# EAGLE schematic FLYTE_3.02 (EAGLE 9.6.2)
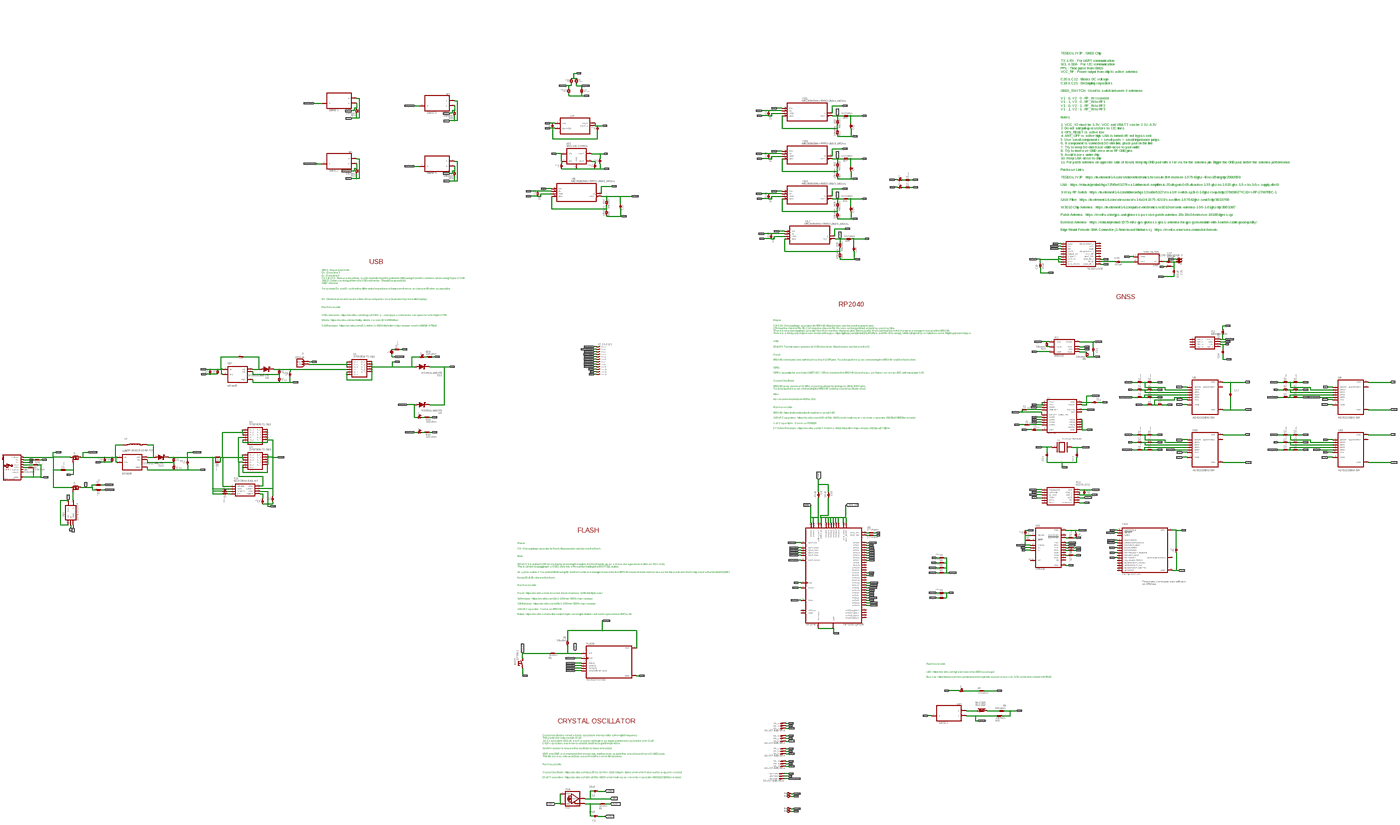
[diagram p0: schematic, sheet 1, overview]
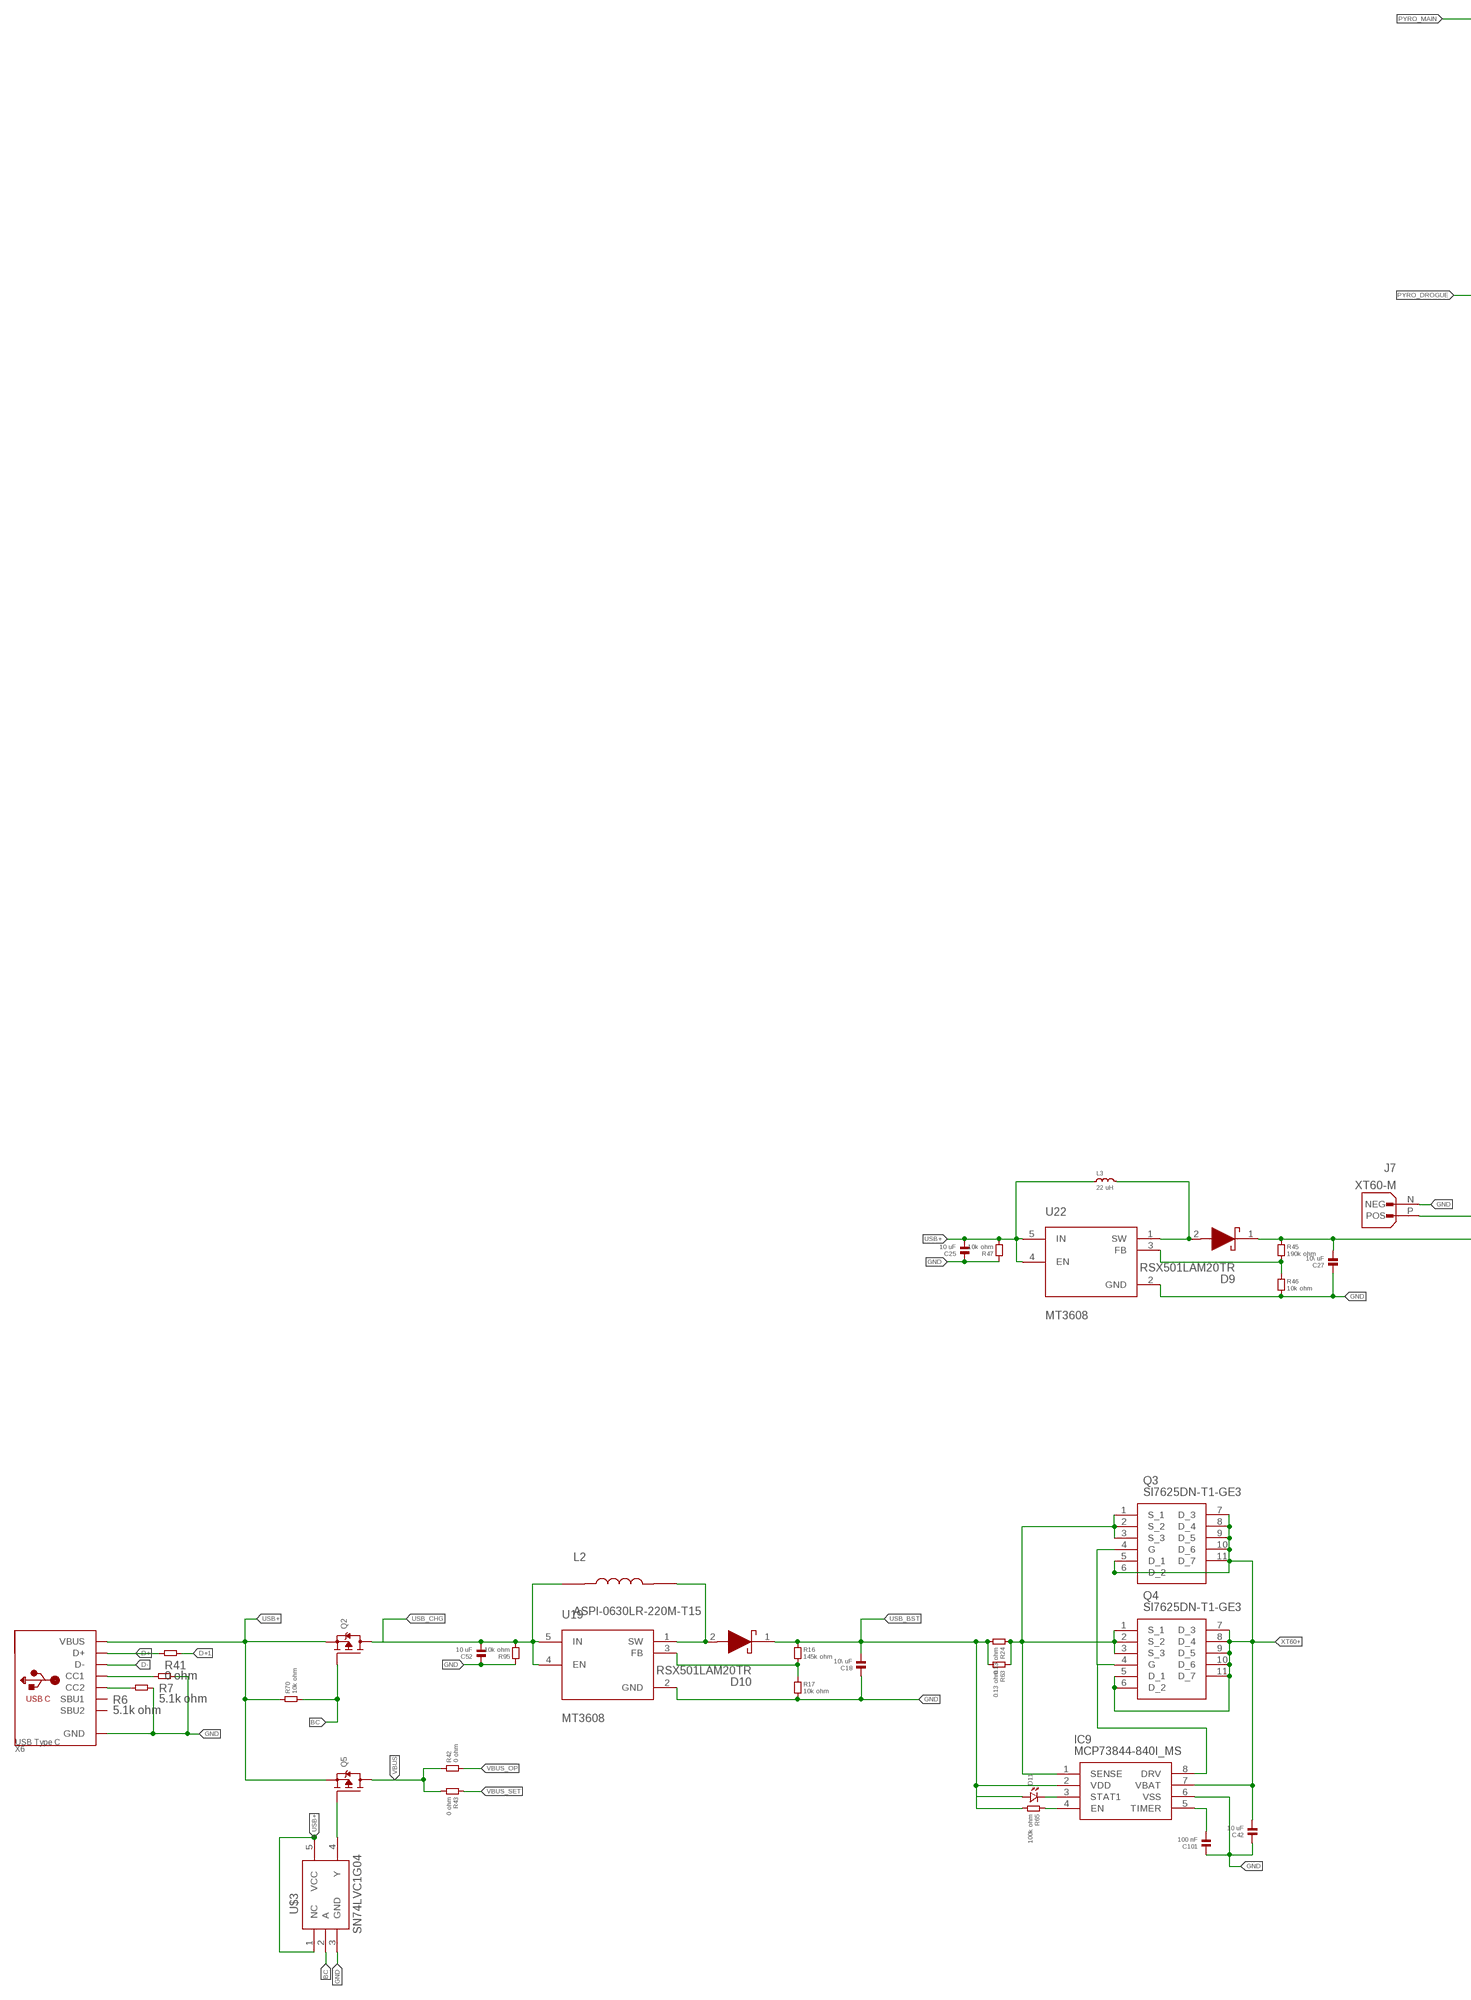
[diagram p1: schematic, sheet 1, part 1 of 6]
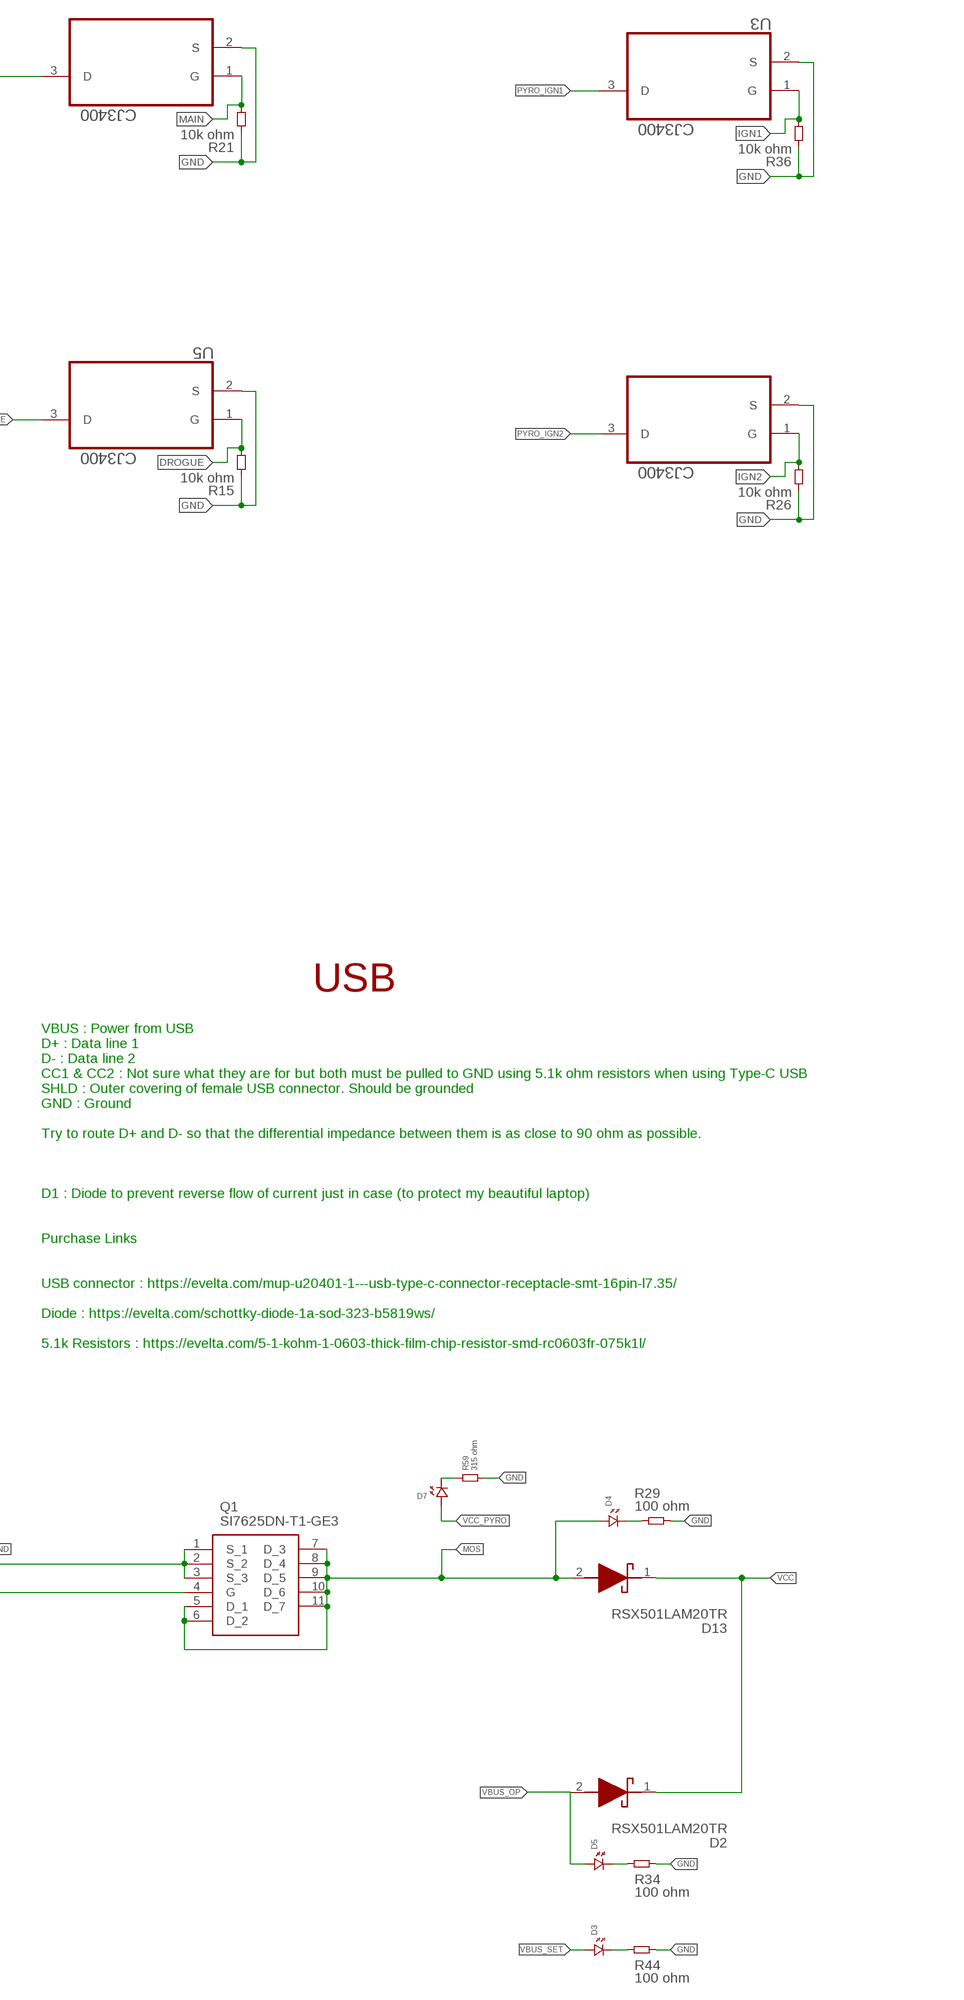
[diagram p2: schematic, sheet 1, part 2 of 6]
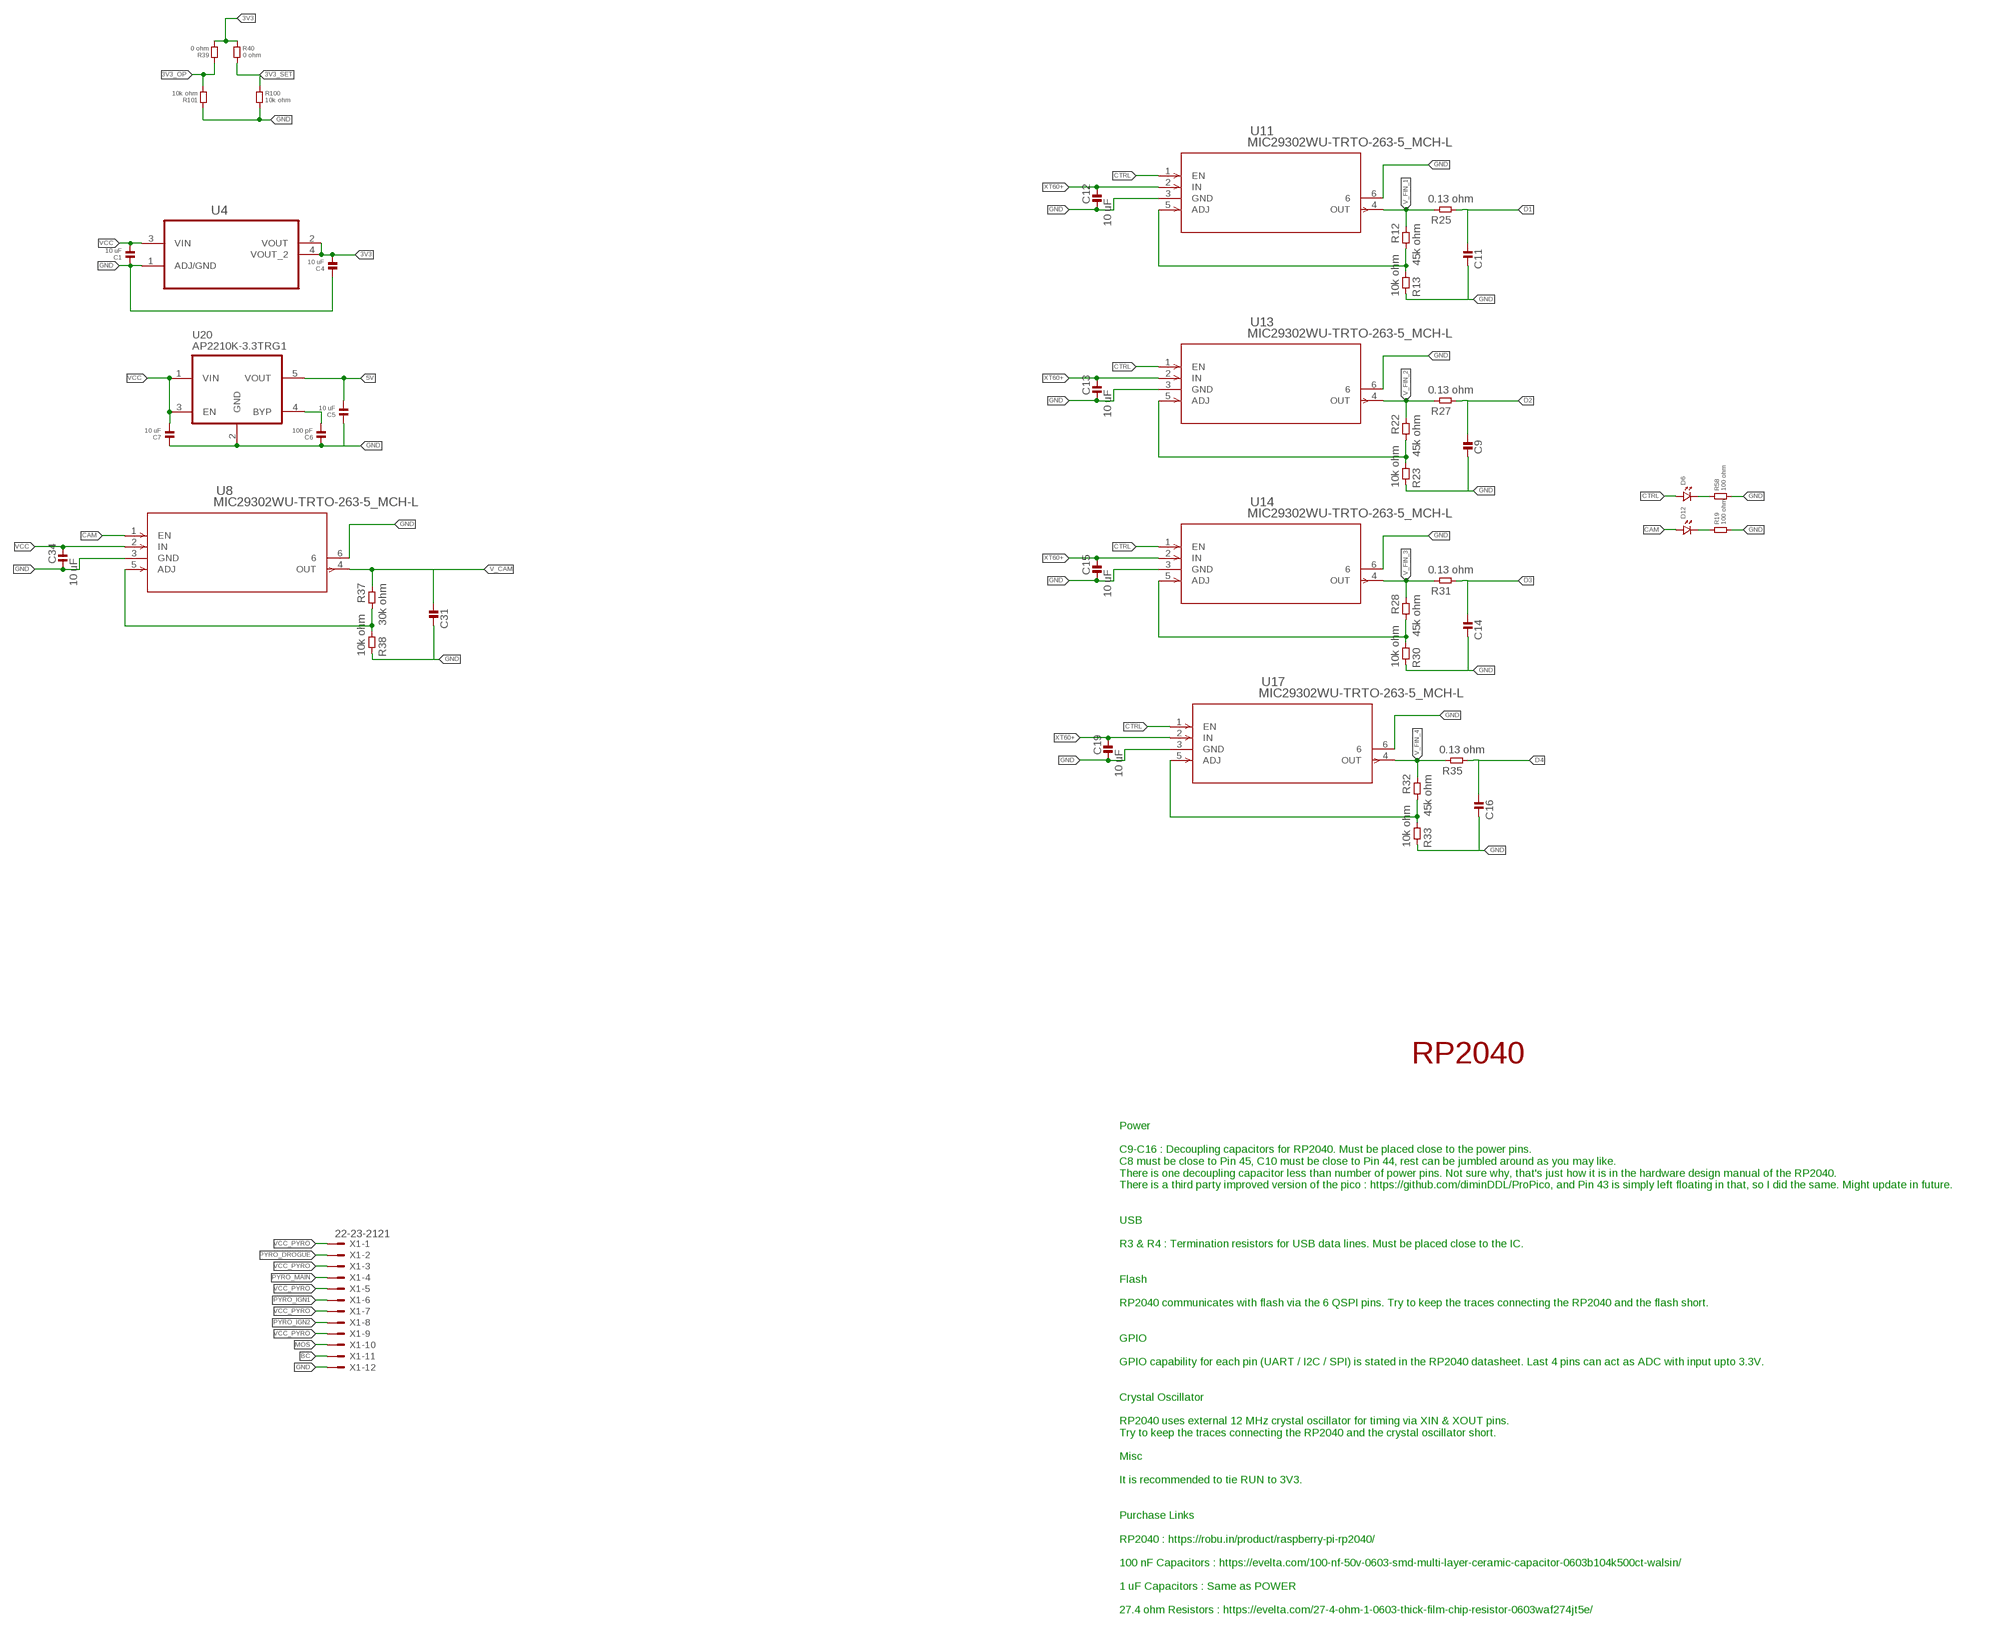
[diagram p3: schematic, sheet 1, part 3 of 6]
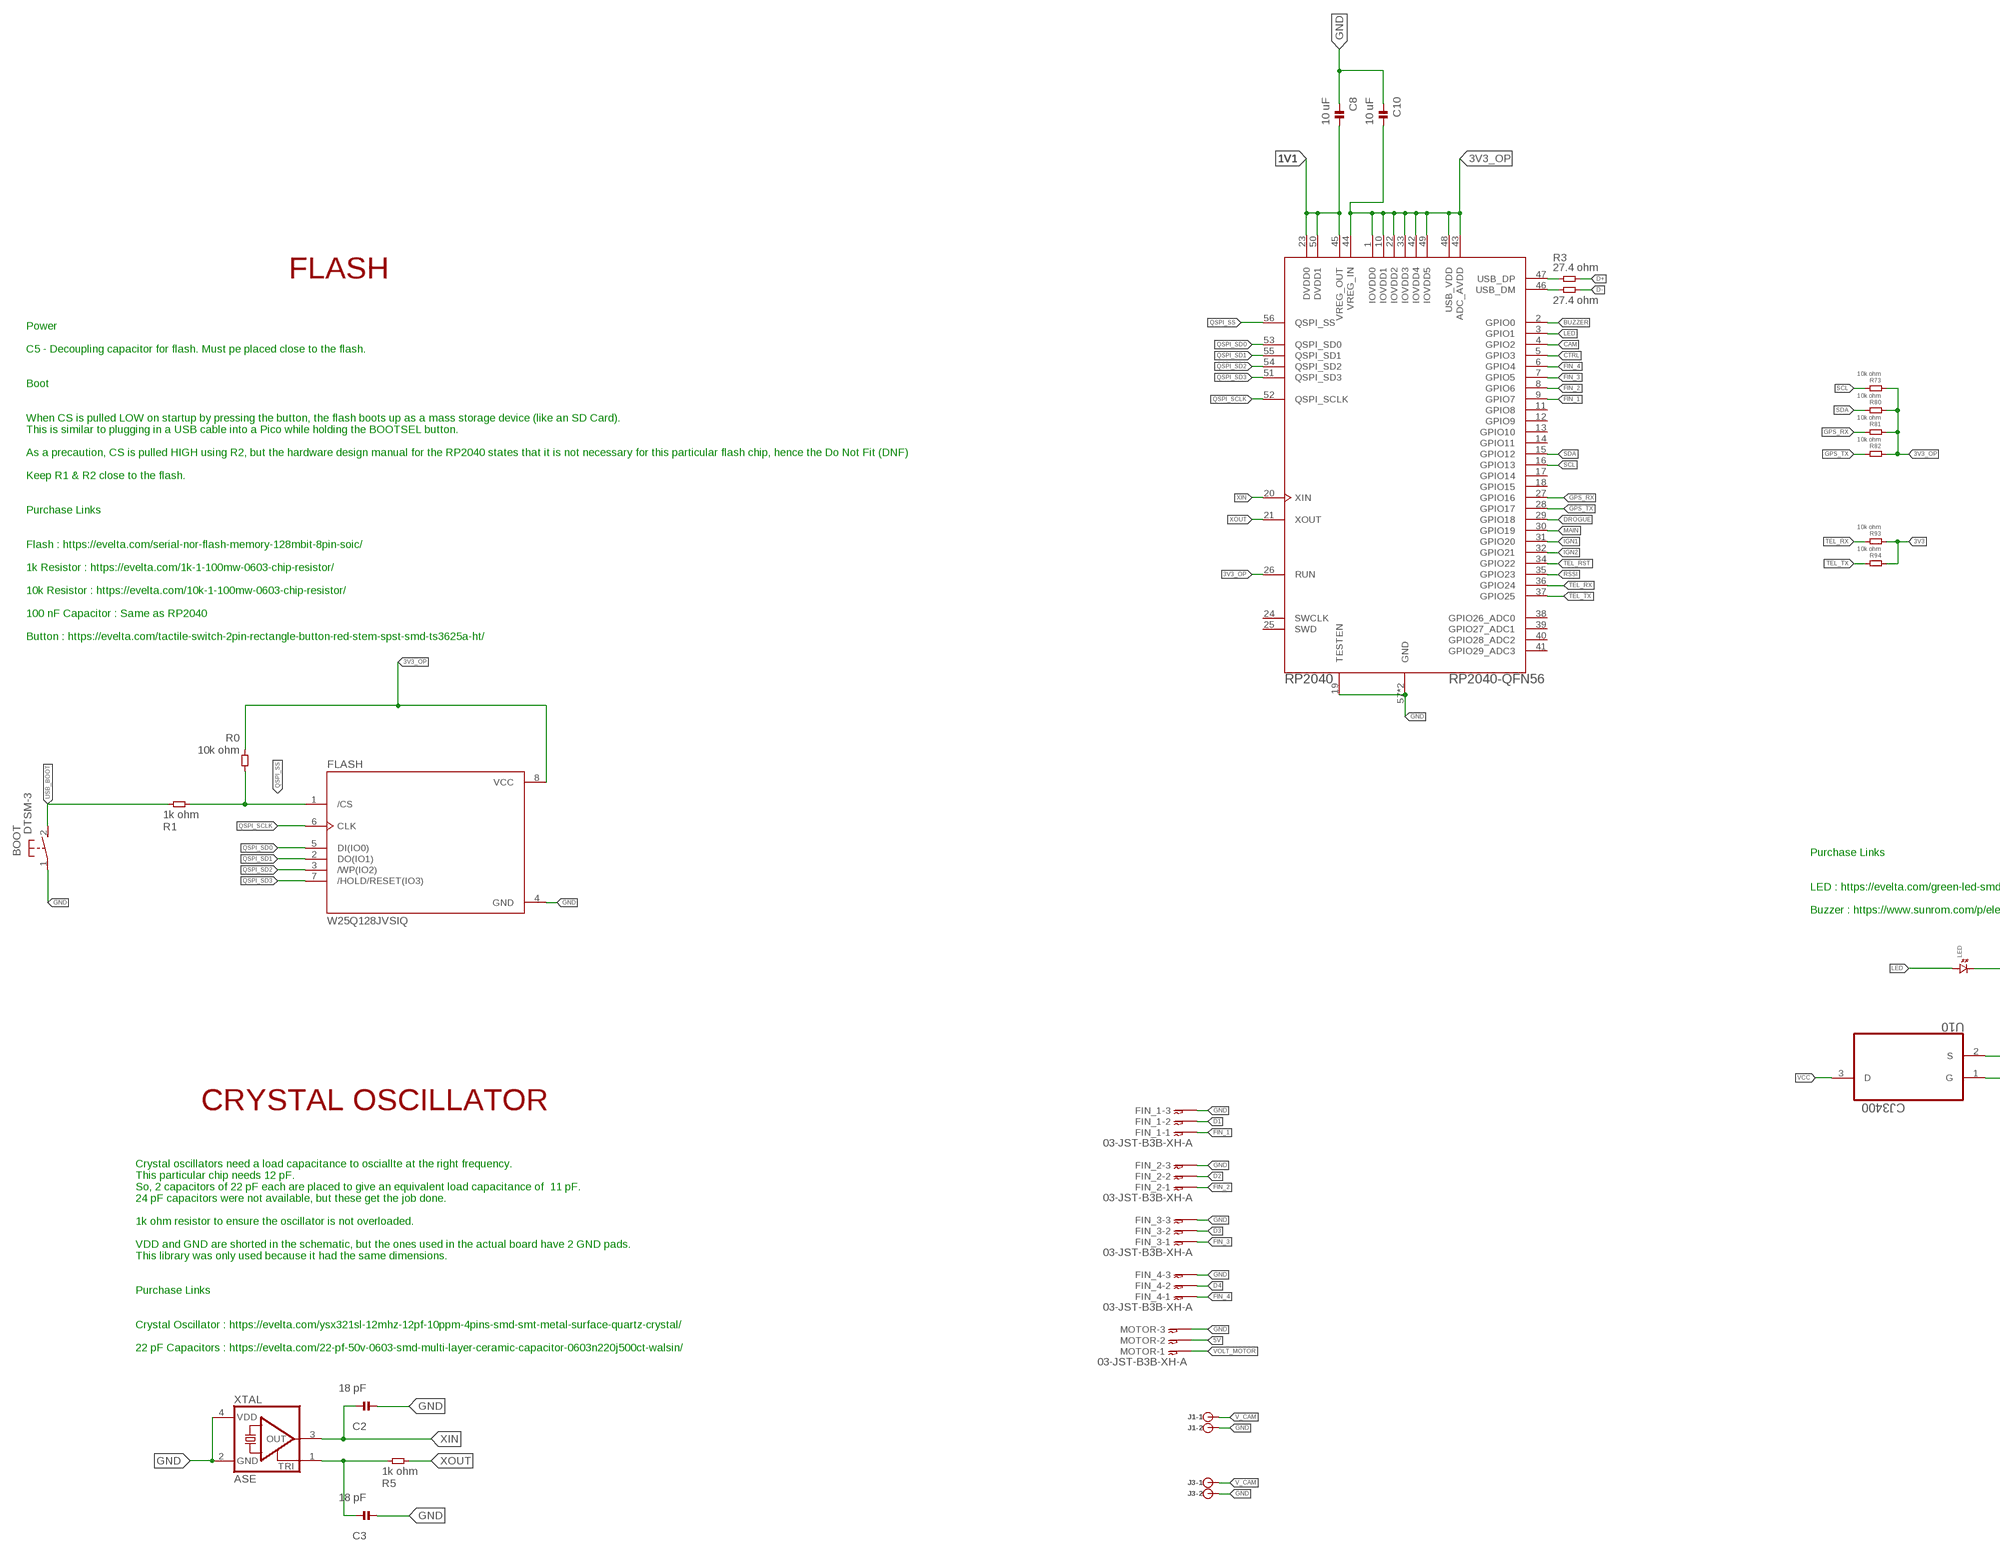
[diagram p4: schematic, sheet 1, part 4 of 6]
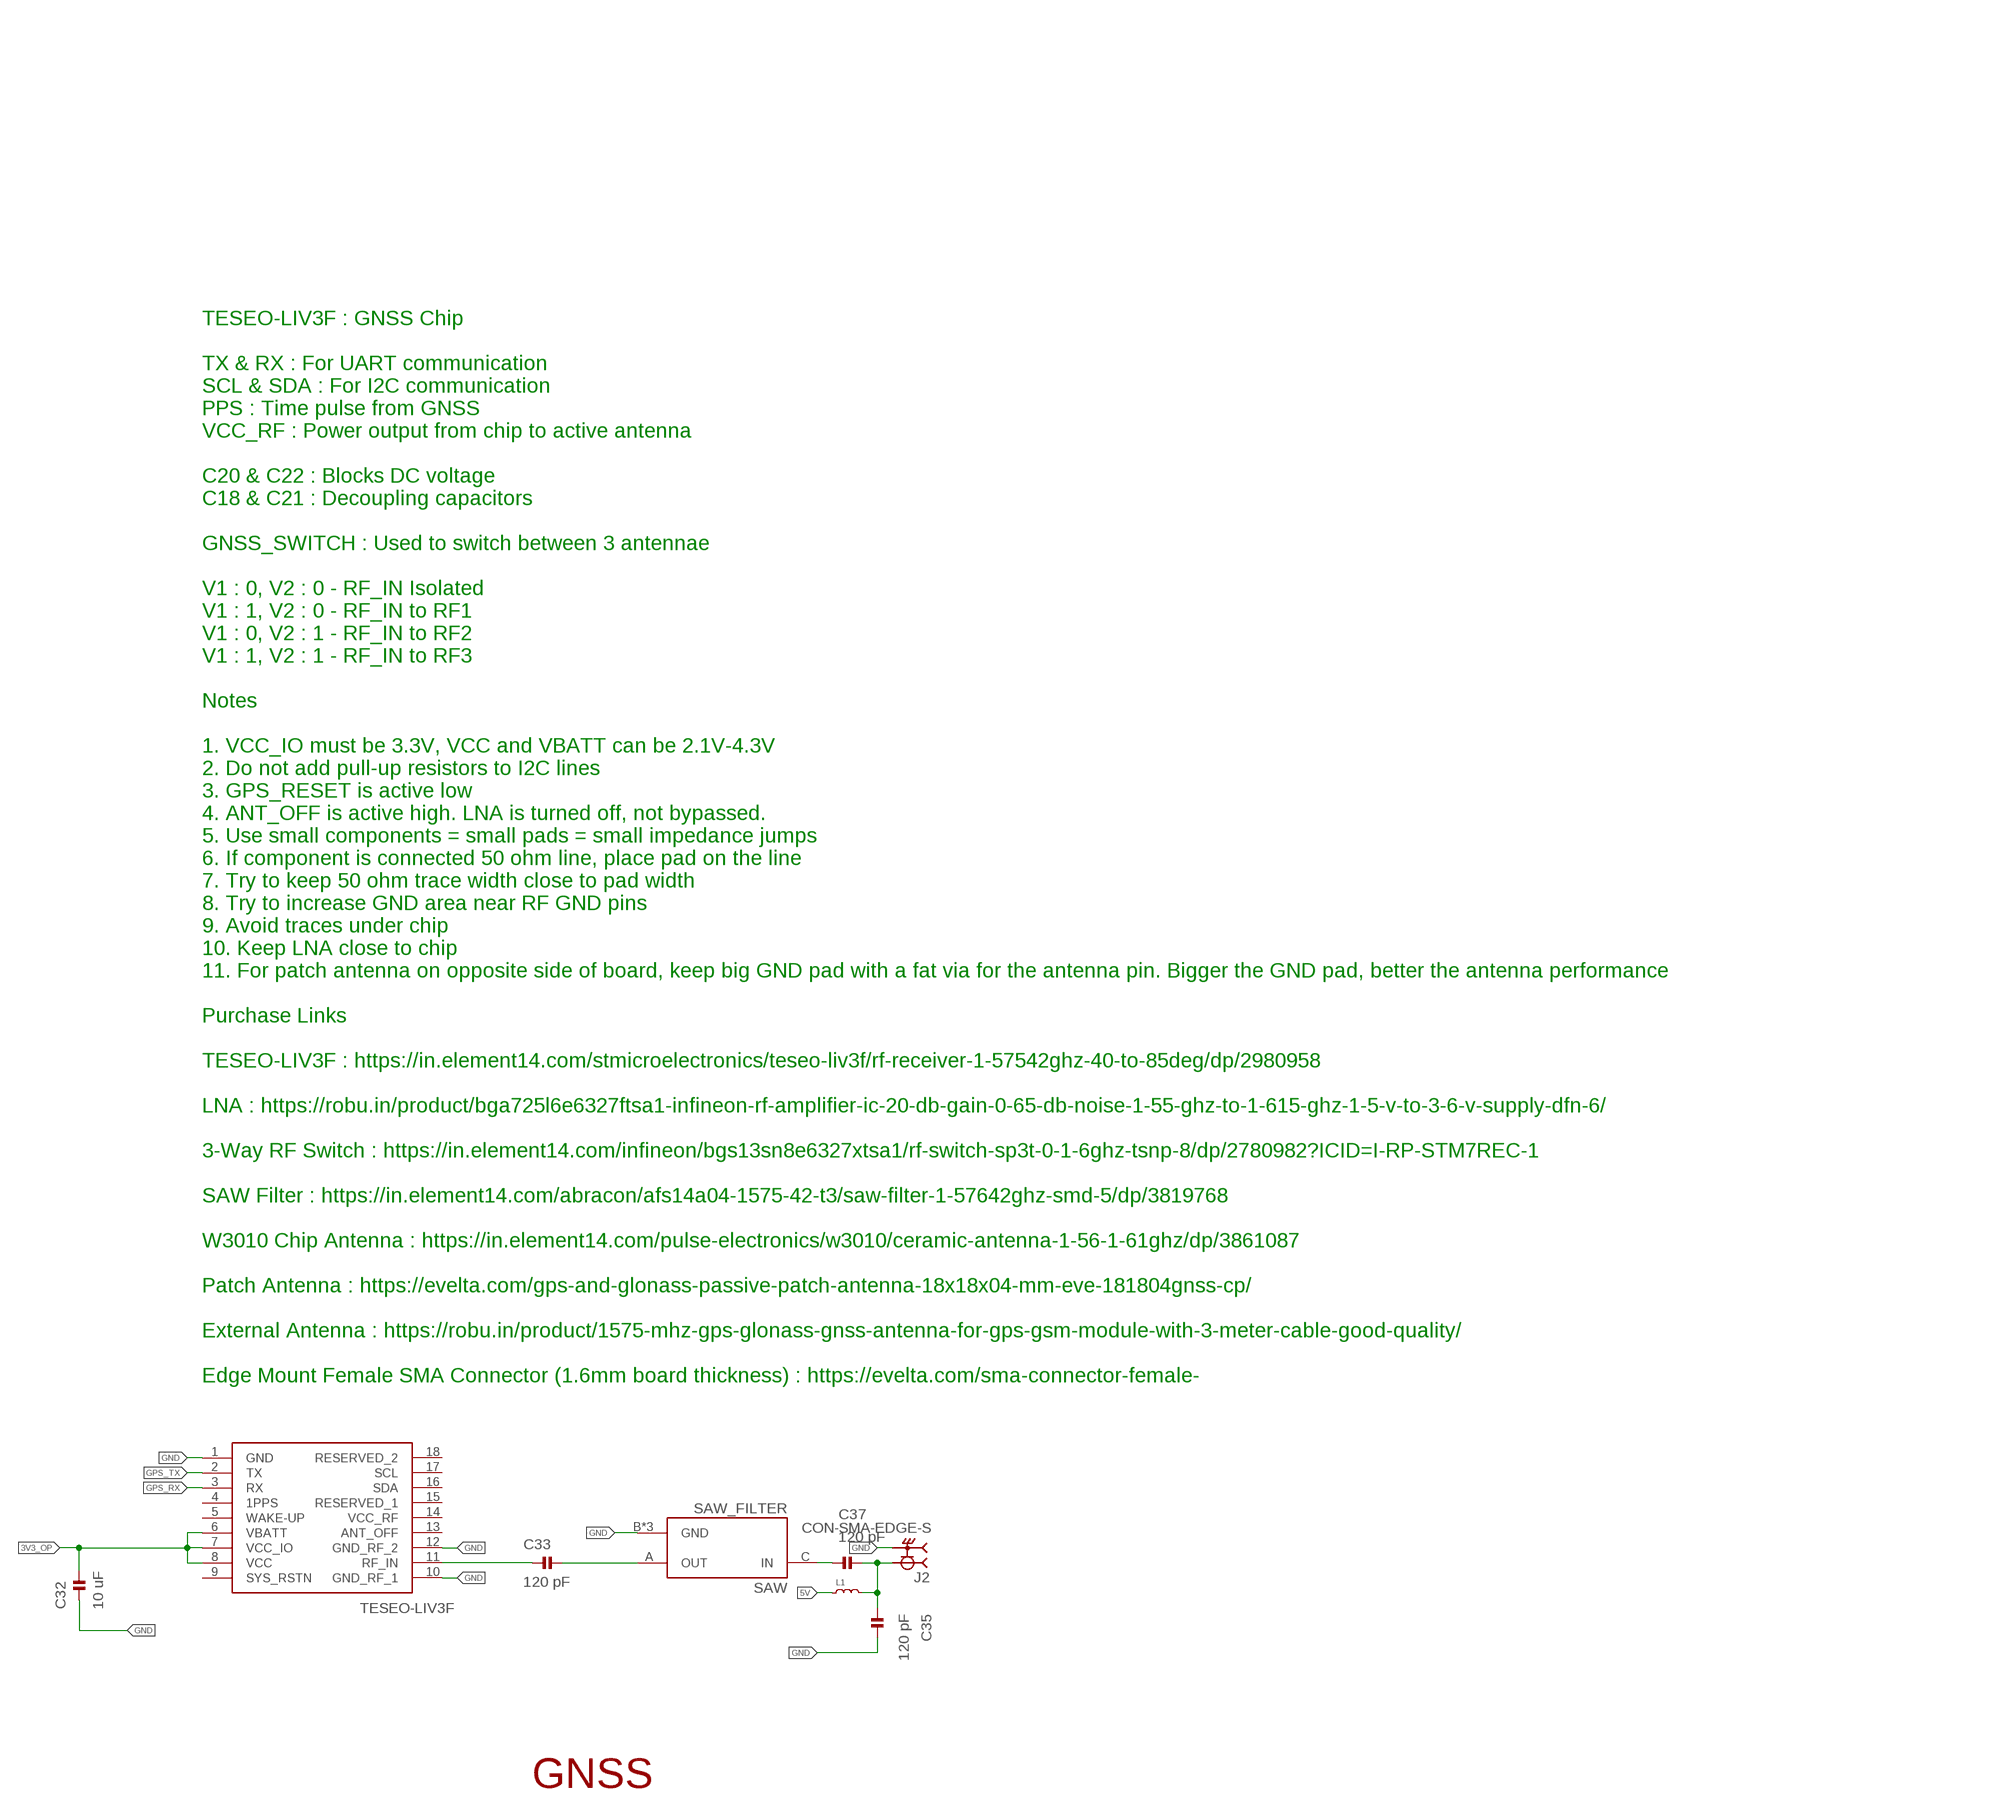
[diagram p5: schematic, sheet 1, part 5 of 6]
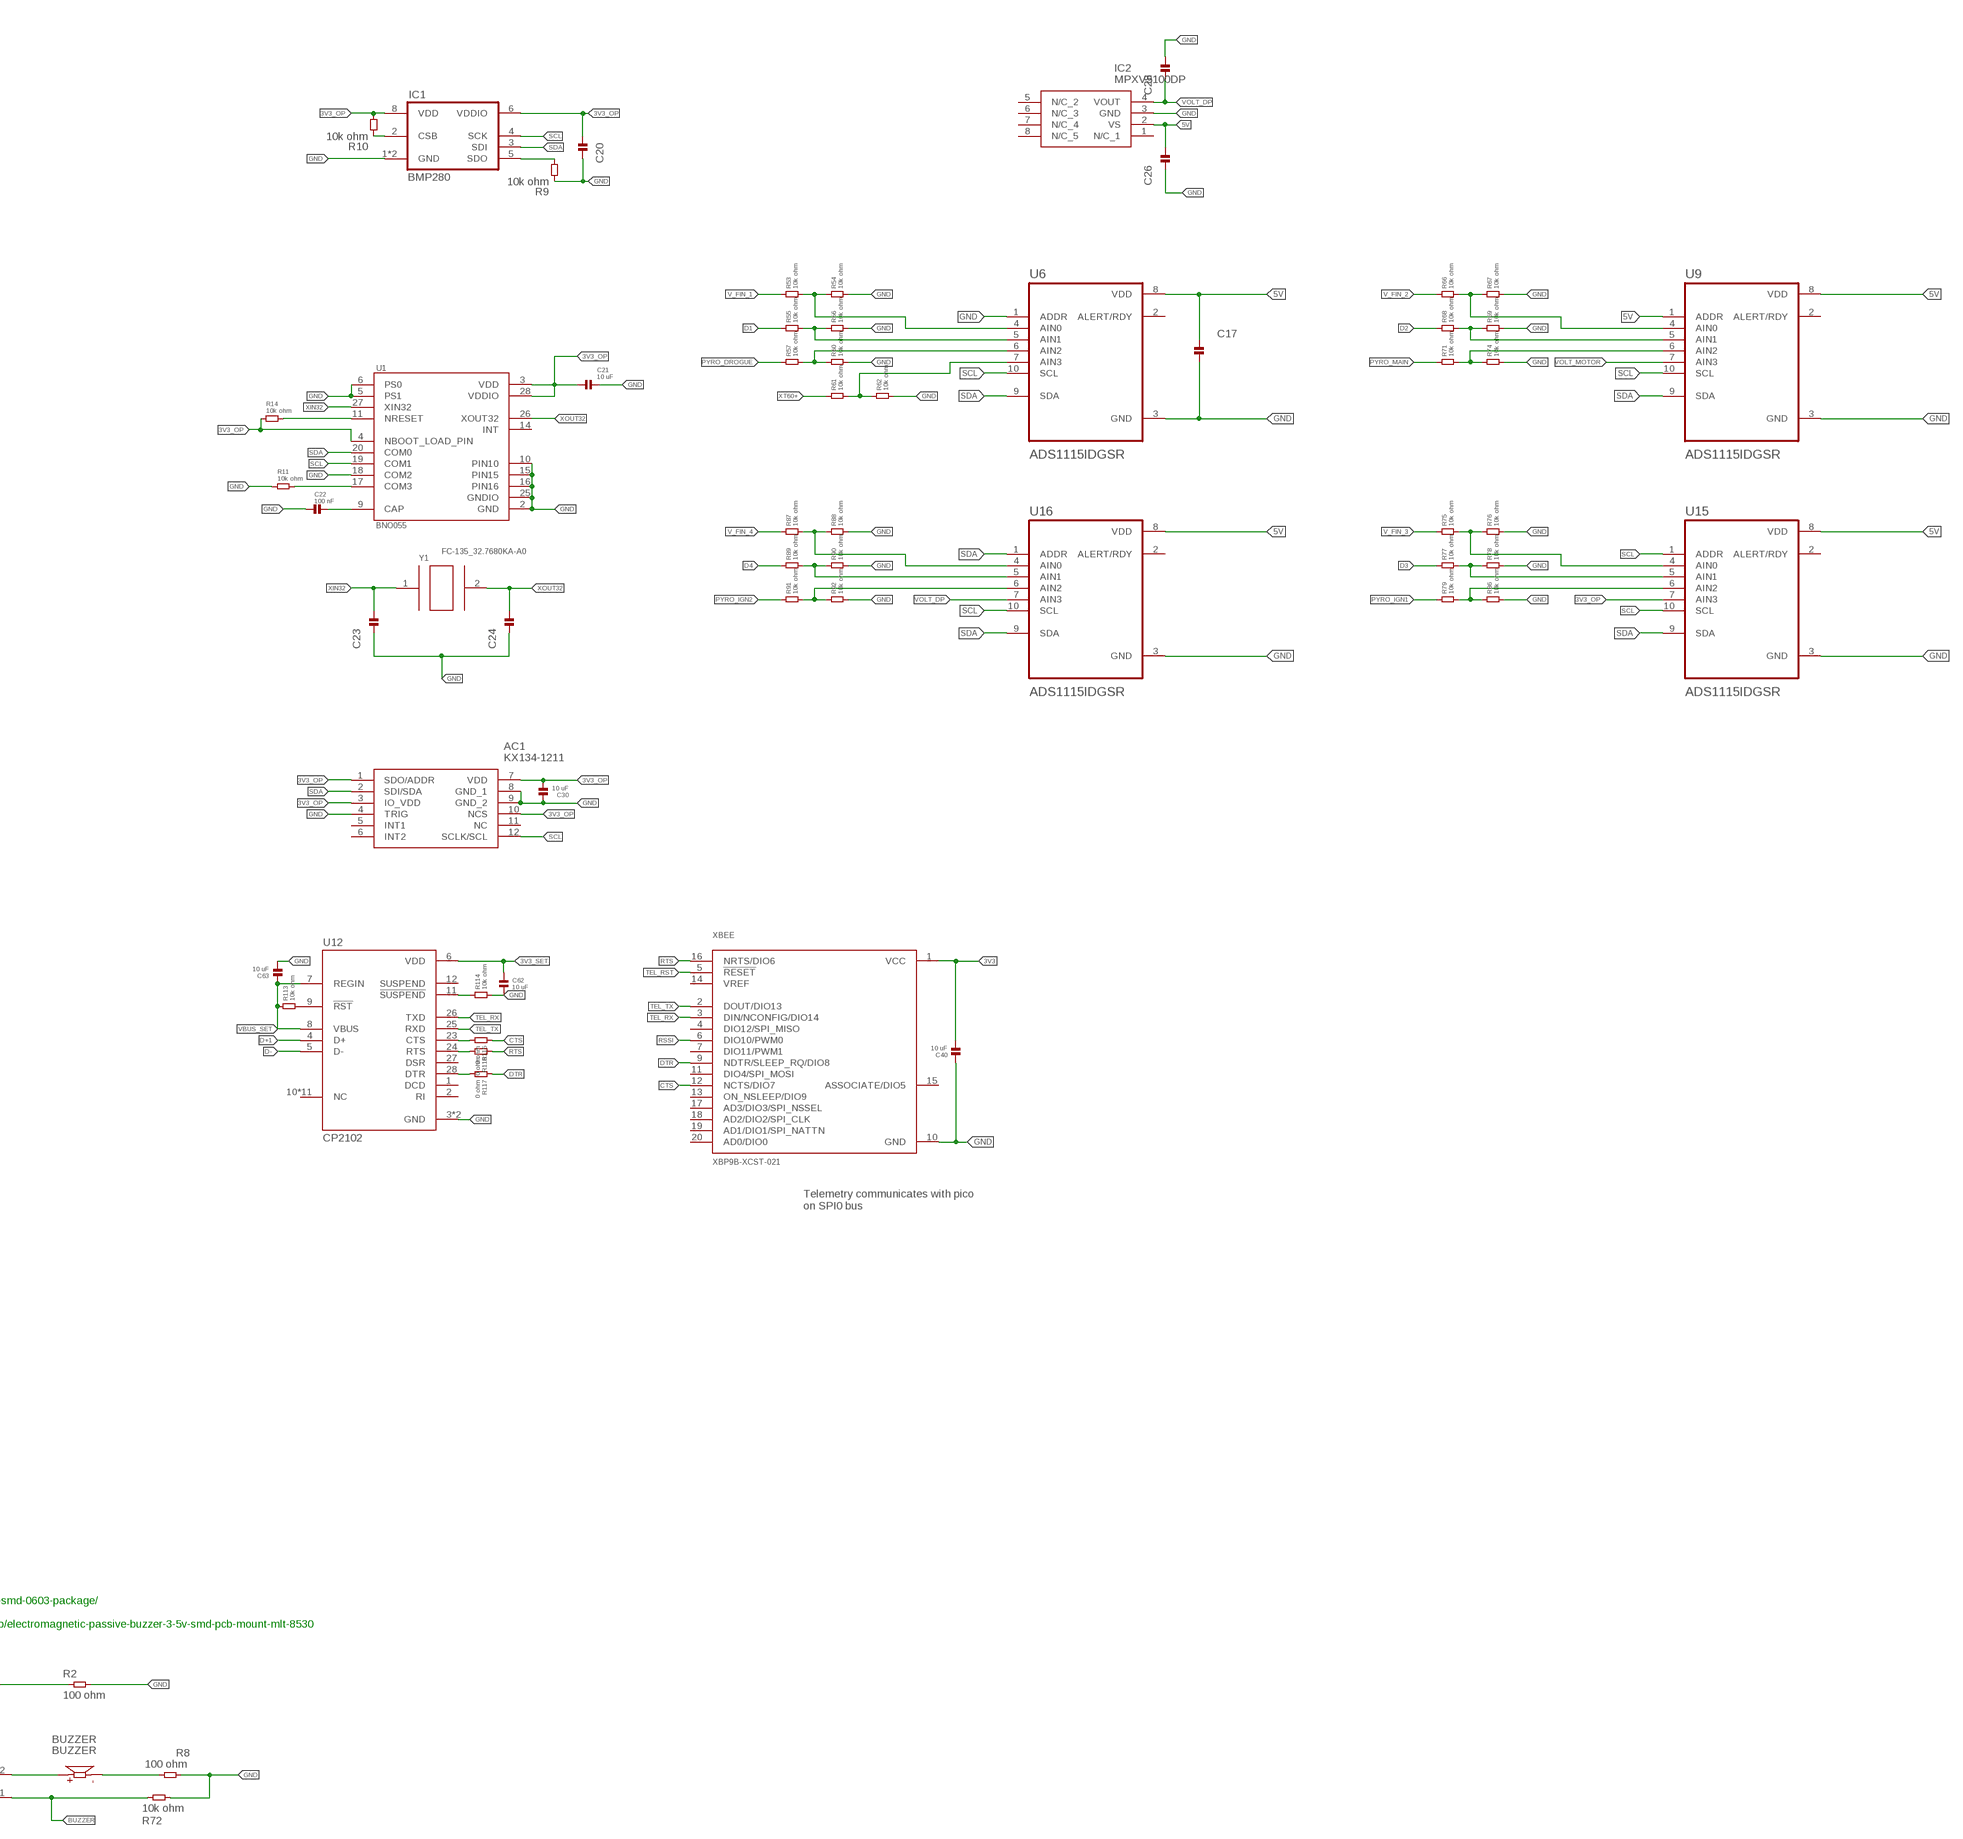
[diagram p6: schematic, sheet 1, part 6 of 6]

## Parts
AC1  KX134-1211  [KX1341211]
BOOT  DTSM-3  [DTSM-3]
BUZZER  BUZZER  CMT-8530S-SMT  [CUI_CMT-8530S-SMT]
C1  10 uF  CAPACITOR.0603  [0603]
C2  18 pF  CAPACITOR.0603  [0603]
C3  18 pF  CAPACITOR.0603  [0603]
C4  10 uF  CAPACITOR.0603  [0603]
C5  10 uF  CAPACITOR.0603  [0603]
C6  100 pF  CAPACITOR.0603  [0603]
C7  10 uF  CAPACITOR.0603  [0603]
C8  10 uF  CAPACITOR.0603  [0603]
C9  10 uF  CAPACITOR.0603  [0603]
C10  10 uF  CAPACITOR.0603  [0603]
C11  10 uF  CAPACITOR.0603  [0603]
C12  10 uF  CAPACITOR.0603  [0603]
C13  10 uF  CAPACITOR.0603  [0603]
C14  10 uF  CAPACITOR.0603  [0603]
C15  10 uF  CAPACITOR.0603  [0603]
C16  10 uF  CAPACITOR.0603  [0603]
C17  10 uF  CAPACITOR.0603  [0603]
C18  10\ uF  CAPACITOR.0603  [0603]
C19  10 uF  CAPACITOR.0603  [0603]
C20  10 uF  CAPACITOR.0603  [0603]
C21  10 uF  CAPACITOR.0603  [0603]
C22  100 nF  CAPACITOR.0603  [0603]
C23  27 pF  CAPACITOR.0603  [0603]
C24  27 pF  CAPACITOR.0603  [0603]
C25  10 uF  CAPACITOR.0603  [0603]
C26  10 uF  CAPACITOR.0603  [0603]
C27  10\ uF  CAPACITOR.0603  [0603]
C28  470 pF  CAPACITOR.0603  [0603]
C30  10 uF  CAPACITOR.0603  [0603]
C31  10 uF  CAPACITOR.0603  [0603]
C32  10 uF  CAPACITOR.0603  [0603]
C33  120 pF  CAPACITOR.0603  [0603]
C34  10 uF  CAPACITOR.0603  [0603]
C35  120 pF  CAPACITOR.0603  [0603]
C37  120 pF  CAPACITOR.0603  [0603]
C40  10 uF  CAPACITOR.0603  [0603]
C42  10 uF  CAPACITOR.0603  [0603]
C52  10 uF  CAPACITOR.0603  [0603]
C62  10 uF  CAPACITOR.0603  [0603]
C63  10 uF  CAPACITOR.0603  [0603]
C101  100 nF  CAPACITOR.0603  [0603]
D2  RSX501LAM20TR  [SODFL4725X105N]
D3  LED.0603  [0603.LED]
D4  LED.0603  [0603.LED]
D5  LED.0603  [0603.LED]
D6  LED.0603  [0603.LED]
D7  LED.0603  [0603.LED]
D9  RSX501LAM20TR  [SODFL4725X105N]
D10  RSX501LAM20TR  [SODFL4725X105N]
D11  LED.0603  [0603.LED]
D12  LED.0603  [0603.LED]
D13  RSX501LAM20TR  [SODFL4725X105N]
FIN_1  03-JST-B3B-XH-A  [B3B-XH]
FIN_2  03-JST-B3B-XH-A  [B3B-XH]
FIN_3  03-JST-B3B-XH-A  [B3B-XH]
FIN_4  03-JST-B3B-XH-A  [B3B-XH]
FLASH  W25Q128JVSIQ  [SOIC127P790X216-8N]
GNSS  TESEO-LIV3F  [SON110P970X1010X230-18N]
IC1  BMP280  [BMP280]
IC2  MPXV5100DP  [MPXV5100DP]
IC9  MCP73844-840I_MS  MCP73843-420I_MS  [SOP65P490X110-8N]
J1  JST-XH-2B  [B2B-XH-A]
J2  CON-SMA-EDGE-S  [RFSOLUTIONS_CON-SMA-EDGE-S]
J3  JST-XH-2B  [B2B-XH-A]
J7  XT60-M  [AMASS_XT60-M]
L1  RF-INDUCTOR.0603  [0603]
L2  ASPI-0630LR-220M-T15  [IND_ASPI-0630LR-220M-T15]
L3  22 uH  RF-INDUCTOR.0603  [0603]
LED  LED.0603  [0603.LED]
MOTOR  03-JST-B3B-XH-A  [B3B-XH]
Q1  SI7625DN-T1-GE3  [SIS862DNT1GE3]
Q2  MOSFET-PWIDE  [SOT23-WIDE]
Q3  SI7625DN-T1-GE3  [SIS862DNT1GE3]
Q4  SI7625DN-T1-GE3  [SIS862DNT1GE3]
Q5  MOSFET-PWIDE  [SOT23-WIDE]
R0  10k ohm  RESISTOR.0603  [0603]
R1  1k ohm  RESISTOR.0603  [0603]
R2  100 ohm  RESISTOR.0603  [0603]
R3  27.4 ohm  RESISTOR.0603  [0603]
R4  27.4 ohm  RESISTOR.0603  [0603]
R5  1k ohm  RESISTOR.0603  [0603]
R6  5.1k ohm  RESISTOR.0603  [0603]
R7  5.1k ohm  RESISTOR.0603  [0603]
R8  100 ohm  RESISTOR.0603  [0603]
R9  10k ohm  RESISTOR.0603  [0603]
R10  10k ohm  RESISTOR.0603  [0603]
R11  10k ohm  RESISTOR.0603  [0603]
R12  45k ohm  RESISTOR.0603  [0603]
R13  10k ohm  RESISTOR.0603  [0603]
R14  10k ohm  RESISTOR.0603  [0603]
R15  10k ohm  RESISTOR.0603  [0603]
R16  145k ohm  RESISTOR.0603  [0603]
R17  10k ohm  RESISTOR.0603  [0603]
R19  100 ohm  RESISTOR.0603  [0603]
R21  10k ohm  RESISTOR.0603  [0603]
R22  45k ohm  RESISTOR.0603  [0603]
R23  10k ohm  RESISTOR.0603  [0603]
R24  0.13 ohm  RESISTOR.0603  [0603]
R25  0.13 ohm  RESISTOR.0603  [0603]
R26  10k ohm  RESISTOR.0603  [0603]
R27  0.13 ohm  RESISTOR.0603  [0603]
R28  45k ohm  RESISTOR.0603  [0603]
R29  100 ohm  RESISTOR.0603  [0603]
R30  10k ohm  RESISTOR.0603  [0603]
R31  0.13 ohm  RESISTOR.0603  [0603]
R32  45k ohm  RESISTOR.0603  [0603]
R33  10k ohm  RESISTOR.0603  [0603]
R34  100 ohm  RESISTOR.0603  [0603]
R35  0.13 ohm  RESISTOR.0603  [0603]
R36  10k ohm  RESISTOR.0603  [0603]
R37  30k ohm  RESISTOR.0603  [0603]
R38  10k ohm  RESISTOR.0603  [0603]
R39  0 ohm  RESISTOR.0603  [0603]
R40  0 ohm  RESISTOR.0603  [0603]
R41  0 ohm  RESISTOR.0805  [0805]
R42  0 ohm  RESISTOR.0603  [0603]
R43  0 ohm  RESISTOR.0603  [0603]
R44  100 ohm  RESISTOR.0603  [0603]
R45  190k ohm  RESISTOR.0603  [0603]
R46  10k ohm  RESISTOR.0603  [0603]
R47  10k ohm  RESISTOR.0603  [0603]
R53  10k ohm  RESISTOR.0603  [0603]
R54  10k ohm  RESISTOR.0603  [0603]
R55  10k ohm  RESISTOR.0603  [0603]
R56  10k ohm  RESISTOR.0603  [0603]
R57  10k ohm  RESISTOR.0603  [0603]
R58  100 ohm  RESISTOR.0603  [0603]
R59  315 ohm  RESISTOR.0603  [0603]
R60  10k ohm  RESISTOR.0603  [0603]
R61  10k ohm  RESISTOR.0603  [0603]
R62  10k ohm  RESISTOR.0603  [0603]
R63  0.13 ohm  RESISTOR.0603  [0603]
R65  100k ohm  RESISTOR.0603  [0603]
R66  10k ohm  RESISTOR.0603  [0603]
R67  10k ohm  RESISTOR.0603  [0603]
R68  10k ohm  RESISTOR.0603  [0603]
R69  10k ohm  RESISTOR.0603  [0603]
R70  10k ohm  RESISTOR.0603  [0603]
R71  10k ohm  RESISTOR.0603  [0603]
R72  10k ohm  RESISTOR.0603  [0603]
R73  10k ohm  RESISTOR.0603  [0603]
R74  10k ohm  RESISTOR.0603  [0603]
R75  10k ohm  RESISTOR.0603  [0603]
R76  10k ohm  RESISTOR.0603  [0603]
R77  10k ohm  RESISTOR.0603  [0603]
R78  10k ohm  RESISTOR.0603  [0603]
R79  10k ohm  RESISTOR.0603  [0603]
R80  10k ohm  RESISTOR.0603  [0603]
R81  10k ohm  RESISTOR.0603  [0603]
R82  10k ohm  RESISTOR.0603  [0603]
R86  10k ohm  RESISTOR.0603  [0603]
R87  10k ohm  RESISTOR.0603  [0603]
R88  10k ohm  RESISTOR.0603  [0603]
R89  10k ohm  RESISTOR.0603  [0603]
R90  10k ohm  RESISTOR.0603  [0603]
R91  10k ohm  RESISTOR.0603  [0603]
R92  10k ohm  RESISTOR.0603  [0603]
R93  10k ohm  RESISTOR.0603  [0603]
R94  10k ohm  RESISTOR.0603  [0603]
R95  10k ohm  RESISTOR.0603  [0603]
R100  10k ohm  RESISTOR.0603  [0603]
R101  10k ohm  RESISTOR.0603  [0603]
R113  10k ohm  RESISTOR.0603  [0603]
R114  10k ohm  RESISTOR.0603  [0603]
R115  0 ohm  RESISTOR.0603  [0603]
R116  0 ohm  RESISTOR.0603  [0603]
R117  0 ohm  RESISTOR.0603  [0603]
RP2040  RP2040-QFN56  [RP2040-QFN-56]
SAW  SAW_FILTER  AFS14A04-1575.42-T3  [FIL_AFS14A04-1575.42-T3]
U1  BNO055  [LGA28R50P4X10_380X520X100]
U2  CJ3400  BS170F  [SOT91P240X120-3N]
U3  CJ3400  BS170F  [SOT91P240X120-3N]
U4  LM1117-3.3  [SOT230]
U5  CJ3400  BS170F  [SOT91P240X120-3N]
U6  ADS1115IDGSR  [SOP50P490X110-10N]
U7  CJ3400  BS170F  [SOT91P240X120-3N]
U8  MIC29302WU-TRTO-263-5_MCH-L  [TO-263-5_MCH-L]
U9  ADS1115IDGSR  [SOP50P490X110-10N]
U10  CJ3400  BS170F  [SOT91P240X120-3N]
U11  MIC29302WU-TRTO-263-5_MCH-L  [TO-263-5_MCH-L]
U12  CP2102  [QFN50P500X500X100-29N]
U13  MIC29302WU-TRTO-263-5_MCH-L  [TO-263-5_MCH-L]
U14  MIC29302WU-TRTO-263-5_MCH-L  [TO-263-5_MCH-L]
U15  ADS1115IDGSR  [SOP50P490X110-10N]
U16  ADS1115IDGSR  [SOP50P490X110-10N]
U17  MIC29302WU-TRTO-263-5_MCH-L  [TO-263-5_MCH-L]
U19  MT3608  [SOT95P280X145-6N]
U20  AP2210K-3.3TRG1  [SOT-23-5_RAW]
U22  MT3608  [SOT95P280X145-6N]
U$3  SN74LVC1G04DBVR  [SOT23-5]
X1  22-23-2121  [22-23-2121]
X6  USB Type C  USB_C  [USB_C_CUSB31-CFM2AX-01-X]
XBEE  XBP9B-XCST-021  [DIP2200W51P200L3294H279Q20P]
XTAL  ASE  [ASE]
Y1  FC-135_32.7680KA-A0  [XTAL_FC-135_32.7680KA-A0]

## Nets
1V1: C8.2 RP2040.23(DVDD0) RP2040.45(VREG_OUT) RP2040.50(DVDD1)
3V3: C4.2 C40.2 R39.2 R40.1 R93.2 R94.2 U4.2(VOUT) U4.4(VOUT_2) XBEE.1(VCC)
3V3_OP: AC1.1(SDO/ADDR) AC1.3(IO_VDD) AC1.7(VDD) AC1.10(NCS) C10.2 C20.2 C21.1 C30.2 C32.2 FLASH.8(VCC) GNSS.6(VBATT) GNSS.7(VCC_IO) GNSS.8(VCC) IC1.6(VDDIO) IC1.8(VDD) R0.2 R10.2 R14.1 R39.1 R73.2 R80.2 R81.2 R82.2 R101.2 RP2040.1(IOVDD0) RP2040.10(IOVDD1) RP2040.22(IOVDD2) RP2040.26(RUN) RP2040.33(IOVDD3) RP2040.42(IOVDD4) RP2040.43(ADC_AVDD) RP2040.44(VREG_IN) RP2040.48(USB_VDD) RP2040.49(IOVDD5) U1.3(VDD) U1.4(NBOOT_LOAD_PIN) U1.28(VDDIO) U15.7(AIN3)
3V3_SET: C62.1 R40.2 R100.1 U12.6(VDD)
5V: C5.2 C17.1 C26.1 IC2.2(VS) L1.1 MOTOR.P$2 U6.8(VDD) U9.1(ADDR) U9.8(VDD) U15.8(VDD) U16.8(VDD) U20.5(VOUT)
BC: Q2.1(G) R70.2 U$3.2(A) X1.11
BUZZER: R72.2 RP2040.2(GPIO0) U10.1(G)
CAM: D12.P$1 RP2040.4(GPIO2) U8.1(EN)
CC1: R7.1 X6.A5(CC1)
CC2: R6.1 X6.B5(CC2)
CSB: IC1.2(CSB) R10.1
CTRL: D6.P$1 RP2040.5(GPIO3) U11.1(EN) U13.1(EN) U14.1(EN) U17.1(EN)
CTS: R115.1 XBEE.12(NCTS/DIO7)
D1: C11.2 FIN_1.P$2 R25.2 R55.1
D2: C9.2 FIN_2.P$2 R27.2 R68.1
D3: C14.2 FIN_3.P$2 R31.2 R77.1
D4: C16.2 FIN_4.P$2 R35.2 R89.1
D+: R3.2 R41.1 X6.A6(D+) X6.B6(D+)
D+1: R41.2 U12.4(D+)
D-: R4.2 U12.5(D-) X6.A7(D-) X6.B7(D-)
DROGUE: R15.2 RP2040.29(GPIO18) U5.1(G)
DTR: R117.1 XBEE.9(NDTR/SLEEP_RQ/DIO8)
FIN_1: FIN_1.P$1 RP2040.9(GPIO7)
FIN_2: FIN_2.P$1 RP2040.8(GPIO6)
FIN_3: FIN_3.P$1 RP2040.7(GPIO5)
FIN_4: FIN_4.P$1 RP2040.6(GPIO4)
GND: AC1.4(TRIG) AC1.8(GND_1) AC1.9(GND_2) BOOT.1 C1.1 C2.1 C3.1 C4.1 C5.1 C6.1 C7.1 C8.1 C9.1 C10.1 C11.1 C12.2 C13.2 C14.1 C15.2 C16.1 C17.2 C18.1 C19.2 C20.1 C21.2 C22.1 C23.2 C24.2 C25.1 C26.2 C27.1 C28.1 C30.1 C31.1 C32.1 C34.2 C35.2 C40.1 C42.1 C52.1 C62.2 C63.2 C101.1 FIN_1.P$3 FIN_2.P$3 FIN_3.P$3 FIN_4.P$3 FLASH.4(GND) GNSS.1(GND) GNSS.10(GND_RF_1) GNSS.12(GND_RF_2) IC1.1(GND) IC1.7(GND) IC2.3(GND) IC9.6(VSS) J1.2 J2.G1 J2.G2 J2.G3 J2.G4 J3.2 J7.N(NEG) MOTOR.P$3 R2.2 R6.2 R7.2 R8.2 R9.1 R11.1 R13.1 R15.1 R17.2 R19.2 R21.1 R23.1 R26.1 R29.1 R30.1 R33.1 R34.1 R36.1 R38.1 R44.1 R46.2 R47.1 R54.2 R56.2 R58.2 R59.2 R60.2 R62.2 R67.2 R69.2 R72.1 R74.2 R76.2 R78.2 R86.2 R88.2 R90.2 R92.2 R95.1 R100.2 R101.1 R114.2 RP2040.19(TESTEN) RP2040.57(GND) RP2040.62(GND) SAW.B(GND) SAW.D(GND) SAW.E(GND) U1.2(GND) U1.5(PS1) U1.6(PS0) U1.10(PIN10) U1.15(PIN15) U1.16(PIN16) U1.18(COM2) U1.25(GNDIO) U2.2(S) U3.2(S) U4.1(ADJ/GND) U5.2(S) U6.1(ADDR) U6.3(GND) U7.2(S) U8.3(GND) U8.6 U9.3(GND) U11.3(GND) U11.6 U12.3(GND) U12.29(GND) U13.3(GND) U13.6 U14.3(GND) U14.6 U15.3(GND) U16.3(GND) U17.3(GND) U17.6 U19.2(GND) U20.2(GND) U22.2(GND) U$3.3(GND) X1.12 X6.A1B12(GND) X6.B1A12(GND) XBEE.10(GND) XTAL.2(GND) XTAL.4(VDD)
GPS_RX: GNSS.3(RX) R81.1 RP2040.27(GPIO16)
GPS_TX: GNSS.2(TX) R82.1 RP2040.28(GPIO17)
IGN1: R36.2 RP2040.31(GPIO20) U3.1(G)
IGN2: R26.2 RP2040.32(GPIO21) U2.1(G)
LED: LED.P$1 RP2040.3(GPIO1)
MAIN: R21.2 RP2040.30(GPIO19) U7.1(G)
MOS: D4.P$1 D13.2(A) Q1.5(D_1) Q1.6(D_2) Q1.7(D_3) Q1.8(D_4) Q1.9(D_5) Q1.10(D_6) Q1.11(D_7) X1.10
N$2: LED.P$2 R2.1
N$3: C3.2 R5.1 XTAL.1(TRI)
N$4: C33.1 GNSS.11(RF_IN)
N$5: R12.2 R13.2 U11.5(ADJ)
N$6: BUZZER.N R8.1
N$7: D12.P$2 R19.1
N$8: IC9.1(SENSE) Q3.1(S_1) Q3.2(S_2) Q3.3(S_3) Q4.1(S_1) Q4.2(S_2) Q4.3(S_3) R24.1 R63.1
N$9: BUZZER.P U10.2(S)
N$10: C22.2 U1.9(CAP)
N$11: R11.2 U1.17(COM3)
N$12: R22.2 R23.2 U13.5(ADJ)
N$13: R28.2 R30.2 U14.5(ADJ)
N$14: R32.2 R33.2 U17.5(ADJ)
N$15: R14.2 U1.11(NRESET)
N$16: D11.P$2 IC9.3(STAT1)
N$17: C35.1 C37.2 J2.1 L1.2
N$18: D10.2(A) L2.2 U19.1(SW)
N$19: R16.2 R17.1 U19.3(FB)
N$20: R55.2 R56.1 U6.5(AIN1)
N$21: R53.2 R54.1 U6.4(AIN0)
N$22: C37.1 SAW.C(IN)
N$23: D3.P$2 R44.2
N$24: C33.2 SAW.A(OUT)
N$26: R113.2 U12.9(!RST)
N$27: R37.2 R38.2 U8.5(ADJ)
N$29: R57.2 R60.1 U6.6(AIN2)
N$30: R61.2 R62.1 U6.7(AIN3)
N$31: R66.2 R67.1 U9.4(AIN0)
N$32: R68.2 R69.1 U9.5(AIN1)
N$33: R71.2 R74.1 U9.6(AIN2)
N$34: R75.2 R76.1 U15.4(AIN0)
N$35: R77.2 R78.1 U15.5(AIN1)
N$36: R79.2 R86.1 U15.6(AIN2)
N$37: R87.2 R88.1 U16.4(AIN0)
N$38: R89.2 R90.1 U16.5(AIN1)
N$39: R91.2 R92.1 U16.6(AIN2)
N$41: R114.1 U12.11(!SUSPEND)
N$42: R115.2 U12.23(CTS)
N$43: R116.2 U12.24(RTS)
N$45: R117.2 U12.28(DTR)
N$46: C6.2 U20.4(BYP)
N$49: D9.2(A) L3.2 U22.1(SW)
N$50: R45.2 R46.1 U22.3(FB)
N$53: C27.2 D9.1(K) Q1.4(G) R45.1
N$54: D4.P$2 R29.2
N$55: D5.P$2 R34.2
N$97: D6.P$2 R58.1
N$98: D7.P$2 R59.1
N$108: IC9.4(EN) R65.1
N$109: IC9.8(DRV) Q3.4(G) Q4.4(G)
N$110: C101.2 IC9.5(TIMER)
N$121: Q5.1(G) U$3.4(Y)
PYRO_DROGUE: R57.1 U5.3(D) X1.2
PYRO_IGN1: R79.1 U3.3(D) X1.6
PYRO_IGN2: R91.1 U2.3(D) X1.8
PYRO_MAIN: R71.1 U7.3(D) X1.4
QSPI_SCLK: FLASH.6(CLK) RP2040.52(QSPI_SCLK)
QSPI_SD0: FLASH.5(DI(IO0)) RP2040.53(QSPI_SD0)
QSPI_SD1: FLASH.2(DO(IO1)) RP2040.55(QSPI_SD1)
QSPI_SD2: FLASH.3(/WP(IO2)) RP2040.54(QSPI_SD2)
QSPI_SD3: FLASH.7(/HOLD/RESET(IO3)) RP2040.51(QSPI_SD3)
QSPI_SS: FLASH.1(/CS) R0.1 R1.2 RP2040.56(QSPI_SS)
RSSI: RP2040.35(GPIO23) XBEE.6(DIO10/PWM0)
RTS: R116.1 XBEE.16(NRTS/DIO6)
SCL: AC1.12(SCLK/SCL) IC1.4(SCK) R73.1 RP2040.16(GPIO13) U1.19(COM1) U6.10(SCL) U9.10(SCL) U15.1(ADDR) U15.10(SCL) U16.10(SCL)
SDA: AC1.2(SDI/SDA) IC1.3(SDI) R80.1 RP2040.15(GPIO12) U1.20(COM0) U6.9(SDA) U9.9(SDA) U15.9(SDA) U16.1(ADDR) U16.9(SDA)
SDO: IC1.5(SDO) R9.2
TEL_RST: RP2040.34(GPIO22) XBEE.5(!RESET)
TEL_RX: R93.1 RP2040.36(GPIO24) U12.26(TXD) XBEE.3(DIN/NCONFIG/DIO14)
TEL_TX: R94.1 RP2040.37(GPIO25) U12.25(RXD) XBEE.2(DOUT/DIO13)
USB+: C25.2 L3.1 Q2.2(S) Q5.2(S) R47.2 R70.1 U22.4(EN) U22.5(IN) U$3.1(NC) U$3.5(VCC) X6.A4B9(VBUS) X6.B4A9(VBUS)
USB_BOOT: BOOT.2 R1.1
USB_BST: C18.2 D10.1(K) D11.P$1 IC9.2(VDD) R16.1 R24.2 R63.2 R65.2
USB_CHG: C52.2 L2.1 Q2.3(D) R95.2 U19.4(EN) U19.5(IN)
USB_DM: R4.1 RP2040.46(USB_DM)
USB_DP: R3.1 RP2040.47(USB_DP)
V_CAM: C31.2 J1.1 J3.1 R37.1 U8.4(OUT)
V_FIN_1: R12.1 R25.1 R53.1 U11.4(OUT)
V_FIN_2: R22.1 R27.1 R66.1 U13.4(OUT)
V_FIN_3: R28.1 R31.1 R75.1 U14.4(OUT)
V_FIN_4: R32.1 R35.1 R87.1 U17.4(OUT)
VBUS: Q5.3(D) R42.1 R43.2
VBUS_OP: D2.2(A) D5.P$1 R42.2
VBUS_SET: C63.1 D3.P$1 R43.1 R113.1 U12.7(REGIN) U12.8(VBUS)
VCC: C1.2 C7.2 C34.1 D2.1(K) D13.1(K) U4.3(VIN) U8.2(IN) U10.3(D) U20.1(VIN) U20.3(EN)
VCC_PYRO: D7.P$1 X1.1 X1.3 X1.5 X1.7 X1.9
VOLT_DP: C28.2 IC2.4(VOUT) U16.7(AIN3)
VOLT_MOTOR: MOTOR.P$1 U9.7(AIN3)
XIN: C2.2 RP2040.20(XIN) XTAL.3(OUT)
XIN32: C23.1 U1.27(XIN32) Y1.1
XOUT: R5.2 RP2040.21(XOUT)
XOUT32: C24.1 U1.26(XOUT32) Y1.2
XT60+: C12.1 C13.1 C15.1 C19.1 C42.2 IC9.7(VBAT) J7.P(POS) Q1.1(S_1) Q1.2(S_2) Q1.3(S_3) Q3.5(D_1) Q3.6(D_2) Q3.7(D_3) Q3.8(D_4) Q3.9(D_5) Q3.10(D_6) Q3.11(D_7) Q4.5(D_1) Q4.6(D_2) Q4.7(D_3) Q4.8(D_4) Q4.9(D_5) Q4.10(D_6) Q4.11(D_7) R61.1 U11.2(IN) U13.2(IN) U14.2(IN) U17.2(IN)
Unconnected: AC1.5(INT1) AC1.6(INT2) AC1.11(NC) GNSS.4(1PPS) GNSS.5(WAKE-UP) GNSS.9(SYS_RSTN) GNSS.13(ANT_OFF) GNSS.14(VCC_RF) GNSS.15(RESERVED_1) GNSS.16(SDA) GNSS.17(SCL) GNSS.18(RESERVED_2) IC2.1(N/C_1) IC2.5(N/C_2) IC2.6(N/C_3) IC2.7(N/C_4) IC2.8(N/C_5) RP2040.11(GPIO8) RP2040.12(GPIO9) RP2040.13(GPIO10) RP2040.14(GPIO11) RP2040.17(GPIO14) RP2040.18(GPIO15) RP2040.24(SWCLK) RP2040.25(SWD) RP2040.38(GPIO26_ADC0) RP2040.39(GPIO27_ADC1) RP2040.40(GPIO28_ADC2) RP2040.41(GPIO29_ADC3) U1.14(INT) U6.2(ALERT/RDY) U9.2(ALERT/RDY) U12.1(DCD) U12.2(RI) U12.10(NC) U12.12(SUSPEND) U12.13(NC) U12.14(NC) U12.15(NC) U12.16(NC) U12.17(NC) U12.18(NC) U12.19(NC) U12.20(NC) U12.21(NC) U12.22(NC) U12.27(DSR) U15.2(ALERT/RDY) U16.2(ALERT/RDY) X6.A8(SBU1) X6.B8(SBU2) XBEE.4(DIO12/SPI_MISO) XBEE.7(DIO11/PWM1) XBEE.11(DIO4/SPI_MOSI) XBEE.13(ON_NSLEEP/DIO9) XBEE.14(VREF) XBEE.15(ASSOCIATE/DIO5) XBEE.17(AD3/DIO3/SPI_NSSEL) XBEE.18(AD2/DIO2/SPI_CLK) XBEE.19(AD1/DIO1/SPI_NATTN) XBEE.20(AD0/DIO0)

## Notes on the sheet
- TESEO-LIV3F : GNSS Chip
  
  TX & RX : For UART communication
  SCL & SDA : For I2C communication
  PPS : Time pulse from GNSS
  VCC_RF : Power output from chip to active antenna
  
  C20 & C22 : Blocks DC voltage
  C18 & C21 : Decoupling capacitors
  
  GNSS_SWITCH : Used to switch between 3 antennae
  
  V1 : 0, V2 : 0 - RF_IN Isolated
  V1 : 1, V2 : 0 - RF_IN to RF1
  V1 : 0, V2 : 1 - RF_IN to RF2
  V1 : 1, V2 : 1 - RF_IN to RF3
  
  Notes
  
  1. VCC_IO must be 3.3V, VCC and VBATT can be 2.1V-4.3V
  2. Do not add pull-up resistors to I2C lines
  3. GPS_RESET is active low
  4. ANT_OFF is active high. LNA is turned off, not bypassed.
  5. Use small components = small pads = small impedance jumps
  6. If component is connected 50 ohm line, place pad on the line
  7. Try to keep 50 ohm trace width close to pad width
  8. Try to increase GND area near RF GND pins
  9. Avoid traces under chip
  10. Keep LNA close to chip
  11. For patch antenna on opposite side of board, keep big GND pad with a fat via for the antenna pin. Bigger the GND pad, better the antenna performance
  
  Purchase Links
  
  TESEO-LIV3F : https://in.element14.com/stmicroelectronics/teseo-liv3f/rf-receiver-1-57542ghz-40-to-85deg/dp/2980958
  
  LNA : https://robu.in/product/bga725l6e6327ftsa1-infineon-rf-amplifier-ic-20-db-gain-0-65-db-noise-1-55-ghz-to-1-615-ghz-1-5-v-to-3-6-v-supply-dfn-6/
  
  3-Way RF Switch : https://in.element14.com/infineon/bgs13sn8e6327xtsa1/rf-switch-sp3t-0-1-6ghz-tsnp-8/dp/2780982?ICID=I-RP-STM7REC-1
  
  SAW Filter : https://in.element14.com/abracon/afs14a04-1575-42-t3/saw-filter-1-57642ghz-smd-5/dp/3819768
  
  W3010 Chip Antenna : https://in.element14.com/pulse-electronics/w3010/ceramic-antenna-1-56-1-61ghz/dp/3861087
  
  Patch Antenna : https://evelta.com/gps-and-glonass-passive-patch-antenna-18x18x04-mm-eve-181804gnss-cp/
  
  External Antenna : https://robu.in/product/1575-mhz-gps-glonass-gnss-antenna-for-gps-gsm-module-with-3-meter-cable-good-quality/
  
  Edge Mount Female SMA Connector (1.6mm board thickness) : https://evelta.com/sma-connector-female-pcb-edge-straight/
  
  10 nF Capacitor : https://evelta.com/10-nf-50v-0603-smd-multi-layer-ceramic-capacitor-0603b103k500ct-walsin/
  
  27 nH Inductor : https://evelta.com/27-nh-0603-surface-mount-high-frequency-inductor-vhf160808h27njt/
  
  10k ohm Resistor : https://evelta.com/10k-1-100mw-0603-chip-resistor/
  
  120 pF Capacitor : https://robu.in/product/mc0603n121j500ct-murata-smd-multilayer-ceramic-capacitor-120-pf-50-v-0603-1608-metric-±-5-c0g-np0-mc/
  
  1 nF Capacitor : https://evelta.com/1-nf-50v-0603-smd-multi-layer-ceramic-capacitor-0603b102k500ct-walsin/
  
  5.6 nH Inductor : https://evelta.com/5-6-nh-0603-surface-mount-high-frequency-inductor-vhf160808h5n6st/
- USB
- GNSS
- RP2040
- VBUS : Power from USB
  D+ : Data line 1
  D- : Data line 2
  CC1 & CC2 : Not sure what they are for but both must be pulled to GND using 5.1k ohm resistors when using Type-C USB
  SHLD : Outer covering of female USB connector. Should be grounded
  GND : Ground
  
  Try to route D+ and D- so that the differential impedance between them is as close to 90 ohm as possible.
  
  
  
  D1 : Diode to prevent reverse flow of current just in case (to protect my beautiful laptop)
  
  
  Purchase Links
  
  
  USB connector : https://evelta.com/mup-u20401-1---usb-type-c-connector-receptacle-smt-16pin-l7.35/
  
  Diode : https://evelta.com/schottky-diode-1a-sod-323-b5819ws/
  
  5.1k Resistors : https://evelta.com/5-1-kohm-1-0603-thick-film-chip-resistor-smd-rc0603fr-075k1l/
- Power
  
  C9-C16 : Decoupling capacitors for RP2040. Must be placed close to the power pins.
  C8 must be close to Pin 45, C10 must be close to Pin 44, rest can be jumbled around as you may like.
  There is one decoupling capacitor less than number of power pins. Not sure why, that's just how it is in the hardware design manual of the RP2040.
  There is a third party improved version of the pico : https://github.com/diminDDL/ProPico, and Pin 43 is simply left floating in that, so I did the same. Might update in future.
  
  
  USB
  
  R3 & R4 : Termination resistors for USB data lines. Must be placed close to the IC.
  
  
  Flash
  
  RP2040 communicates with flash via the 6 QSPI pins. Try to keep the traces connecting the RP2040 and the flash short.
  
  
  GPIO
  
  GPIO capability for each pin (UART / I2C / SPI) is stated in the RP2040 datasheet. Last 4 pins can act as ADC with input upto 3.3V.
  
  
  Crystal Oscillator
  
  RP2040 uses external 12 MHz crystal oscillator for timing via XIN & XOUT pins.
  Try to keep the traces connecting the RP2040 and the crystal oscillator short.
  
  Misc
  
  It is recommended to tie RUN to 3V3.
  
  
  Purchase Links
  
  RP2040 : https://robu.in/product/raspberry-pi-rp2040/
  
  100 nF Capacitors : https://evelta.com/100-nf-50v-0603-smd-multi-layer-ceramic-capacitor-0603b104k500ct-walsin/
  
  1 uF Capacitors : Same as POWER
  
  27.4 ohm Resistors : https://evelta.com/27-4-ohm-1-0603-thick-film-chip-resistor-0603waf274jt5e/
- FLASH
- Telemetry communicates with pico 
  on SPI0 bus
- Power
  
  C5 - Decoupling capacitor for flash. Must pe placed close to the flash.
  
  
  Boot
  
  
  When CS is pulled LOW on startup by pressing the button, the flash boots up as a mass storage device (like an SD Card). 
  This is similar to plugging in a USB cable into a Pico while holding the BOOTSEL button.
  
  As a precaution, CS is pulled HIGH using R2, but the hardware design manual for the RP2040 states that it is not necessary for this particular flash chip, hence the Do Not Fit (DNF)
  
  Keep R1 & R2 close to the flash.
  
  
  Purchase Links
  
  
  Flash : https://evelta.com/serial-nor-flash-memory-128mbit-8pin-soic/
  
  1k Resistor : https://evelta.com/1k-1-100mw-0603-chip-resistor/
  
  10k Resistor : https://evelta.com/10k-1-100mw-0603-chip-resistor/
  
  100 nF Capacitor : Same as RP2040
  
  Button : https://evelta.com/tactile-switch-2pin-rectangle-button-red-stem-spst-smd-ts3625a-ht/
- Purchase Links
  
  
  LED : https://evelta.com/green-led-smd-0603-package/
  
  Buzzer : https://www.sunrom.com/p/electromagnetic-passive-buzzer-3-5v-smd-pcb-mount-mlt-8530
- CRYSTAL OSCILLATOR
- Crystal oscillators need a load capacitance to osciallte at the right frequency.
  This particular chip needs 12 pF.
  So, 2 capacitors of 22 pF each are placed to give an equivalent load capacitance of  11 pF. 
  24 pF capacitors were not available, but these get the job done.
  
  1k ohm resistor to ensure the oscillator is not overloaded.
  
  VDD and GND are shorted in the schematic, but the ones used in the actual board have 2 GND pads.
  This library was only used because it had the same dimensions.
  
  
  Purchase Links
  
  
  Crystal Oscillator : https://evelta.com/ysx321sl-12mhz-12pf-10ppm-4pins-smd-smt-metal-surface-quartz-crystal/
  
  22 pF Capacitors : https://evelta.com/22-pf-50v-0603-smd-multi-layer-ceramic-capacitor-0603n220j500ct-walsin/

## Library data of the parts
AC1 = KX134-1211:KX134-1211: Accelerometers Tri-Axis Acclrmtr 8g, 16g, 32g Source: Datasheet <https://www.mouser.it/datasheet/2/348/KX134-1211-Specifications-Rev-1.0-1659717.pdf>; DESCRIPTION: Accelerometers Tri-Axis Acclrmtr 8g, 16g, 32g; HEIGHT: 1mm; MANUFACTURER_NAME: Kionix; MANUFACTURER_PART_NUMBER: KX134-1211
BOOT = switch-tact:DTSM-3
BUZZER = CMT-8530S-SMT:CMT-8530S-SMT: 8.5 mm, 3.6 Vo-p, 90 dB, Surface Mount (SMT), Magnetic Audio Transducer Buzzer Check availability <https://pricing.snapeda.com/parts/CMT-8530S-SMT-TR/CUI%20Devices/view-part?ref=eda>; AVAILABILITY: In Stock; CHECK_PRICES: https://www.snapeda.com/parts/CMT-8530S-SMT-TR/CUI+Devices/view-part/?ref=eda; CUI_PURCHASE_URL: https://www.cuidevices.com/product/audio/buzzers/audio-transducers/cmt-8530s-smt-tr?utm_source=snapeda.com&utm_medium=referral&utm_campaign=snapedaBOM; DESCRIPTION: 8.5 mm, 3.6 Vo-p, 90 dB, Surface Mount (SMT), Magnetic Audio Transducer Buzzer; MF: CUI Devices; MP: CMT-8530S-SMT-TR; PACKAGE: None; PRICE: None; PURCHASE-URL: https://www.snapeda.com/api/url_track_click_mouser/?unipart_id=649163&manufacturer=CUI Devices&part_name=CMT-8530S-SMT-TR&search_term=None; SNAPEDA_LINK: https://www.snapeda.com/parts/CMT-8530S-SMT-TR/CUI+Devices/view-part/?ref=snap
C1-C28 C30-C35 C37 C40 C42 C52 C62 C63 C101 = standardparts:CAPACITOR
D2 D9 D10 D13 = RSX501LAM20TR:RSX501LAM20TR: 20V, 5A, SOD-128, Schottky Barrier Diode Source: Datasheet <https://fscdn.rohm.com/en/products/databook/datasheet/discrete/diode/schottky_barrier/rsx501lam20tr-e.pdf>; DESCRIPTION: 20V, 5A, SOD-128, Schottky Barrier Diode; HEIGHT: 1.05mm; MANUFACTURER_NAME: ROHM Semiconductor; MANUFACTURER_PART_NUMBER: RSX501LAM20TR
D3-D7 D11 D12 LED = standardparts:LED
FIN_1-FIN_4 MOTOR = bt_con-jst-xh (1):03-JST: JST CONNECTOR
FLASH = W25Q128JVSIQ:W25Q128JVSIQ: Check availability <https://pricing.snapeda.com/parts/W25Q128JVSIQ/Winbond%20Electronics/view-part?ref=eda>; AVAILABILITY: In Stock; CHECK_PRICES: https://www.snapeda.com/parts/W25Q128JVSIQ/Winbond+Electronics/view-part/?ref=eda; DESCRIPTION: FLASH - NOR Memory IC 128Mb (16M x 8) SPI - Quad I/O, QPI, DTR 133 MHz 8-SOIC; MF: Winbond Electronics; MP: W25Q128JVSIQ; PACKAGE: SOIC-8 Winbond Electronics; PRICE: None; SNAPEDA_LINK: https://www.snapeda.com/parts/W25Q128JVSIQ/Winbond+Electronics/view-part/?ref=snap
GNSS = TESEO-LIV3F:TESEO-LIV3F: GPS Modules Tiny GNSS module Source: Datasheet <https://componentsearchengine.com/Datasheets/1/TESEO-LIV3F.pdf> Check availability <https://pricing.snapeda.com/parts/TESEO-LIV3F/STMicroelectronics/view-part?ref=eda>; AVAILABILITY: In Stock; CHECK_PRICES: https://www.snapeda.com/parts/TESEO-LIV3F/STMicroelectronics/view-part/?ref=eda; DESCRIPTION: - RF Receiver BeiDou, Galileo, GLONASS, GNSS, GPS 1.575GHz -163dBm Not Included 18-LCC (9.7x10.1); MF: STMicroelectronics; MP: TESEO-LIV3F; PACKAGE: SMD-18 STMicroelectronics; PRICE: None; PURCHASE-URL: https://www.snapeda.com/api/url_track_click_mouser/?unipart_id=1474256&manufacturer=STMicroelectronics&part_name=TESEO-LIV3F&search_term=None; SNAPEDA_LINK: https://www.snapeda.com/parts/TESEO-LIV3F/STMicroelectronics/view-part/?ref=snap
IC1 = BMP280-standalone:BMP280: The BMP280 is an absolute barometric pressure sensor especially designed for mobile applications. The sensor module is housed in an extremely compact 8-pin metal-lid LGA package with a footprint of only 2.0 × 2.5 mm2 and 0.95 mm package height. Its small dimensions and its low power consumption of 2.7 μA @1Hz allow the implementation in battery driven devices such as mobile phones, GPS modules or watches. The library has been designed by Richard Magdycz <https://www.facebook.com/groups/eaglecadsoftUK>
IC2 = MPXV5100DP:MPXV5100DP: Board Mount Pressure Sensors SOP DUAL PORT Source: Datasheet <http://www.nxp.com/docs/en/data-sheet/MPX5100.pdf>; DESCRIPTION: Board Mount Pressure Sensors SOP DUAL PORT; HEIGHT: 9.906mm; MANUFACTURER_NAME: NXP; MANUFACTURER_PART_NUMBER: MPXV5100DP
IC9 = MCP73843-420I_MS:MCP73843-420I_MS: Li-Ion Charge Controller 4.2V MSOP8 Source: Datasheet <http://ww1.microchip.com/downloads/en/DeviceDoc/21823D.pdf>; DESCRIPTION: Li-Ion Charge Controller 4.2V MSOP8; HEIGHT: 1.1mm; MANUFACTURER_NAME: Microchip; MANUFACTURER_PART_NUMBER: MCP73843-420I/MS
J1 J3 = con-JST-XH:JST-XH-2; MF: JST; MPN: B2B-XH-A
J2 = CON-SMA-EDGE-S:CON-SMA-EDGE-S: Check availability <https://pricing.snapeda.com/parts/CON-SMA-EDGE-S/RF%20Solutions/view-part?ref=eda>; AVAILABILITY: In Stock; CHECK_PRICES: https://www.snapeda.com/parts/CON-SMA-EDGE-S/RF+Solutions/view-part/?ref=eda; DESCRIPTION: SMA Connector Jack, Female Socket - Board Edge, End Launch Solder; MF: RF Solutions; MP: CON-SMA-EDGE-S; PACKAGE: None; PRICE: None; PURCHASE-URL: https://www.snapeda.com/api/url_track_click_mouser/?unipart_id=557794&manufacturer=RF Solutions&part_name=CON-SMA-EDGE-S&search_term=None; SNAPEDA_LINK: https://www.snapeda.com/parts/CON-SMA-EDGE-S/RF+Solutions/view-part/?ref=snap
J7 = XT60-M:XT60-M: Check availability <https://pricing.snapeda.com/parts/XT60-M/AMASS/view-part?ref=eda>; AVAILABILITY: Not in stock; DESCRIPTION: Plug; DC supply; XT60; male; PIN: 2; for cable; soldered; 30A; 500V; MF: AMASS; MP: XT60-M; PACKAGE: Package; PRICE: None
L1 L3 = standardparts:RF-INDUCTOR
L2 = ASPI-0630LR-220M-T15:ASPI-0630LR-220M-T15; MANUFACTURER: Abracon; MAXIMUM_PACKAGE_HEIGHT: 3.0 mm; PARTREV: B; STANDARD: Manufacturer Recommendations
Q1 Q3 Q4 = SI7625DN-T1-GE3:SI7625DN-T1-GE3: VISHAY - SI7625DN-T1-GE3 - MOSFET, P CHANNEL, -30V, -35A, POWERPAK 1212-8 Source: Datasheet <https://www.vishay.com/docs/65737/si7625dn.pdf>; DESCRIPTION: VISHAY - SI7625DN-T1-GE3 - MOSFET, P CHANNEL, -30V, -35A, POWERPAK 1212-8; HEIGHT: 1.12mm; MANUFACTURER_NAME: Vishay; MANUFACTURER_PART_NUMBER: SI7625DN-T1-GE3
Q2 Q5 = microbuilder:MOSFET-P: P-Channel Mosfet LEGEND VDS: Voltage Drain-Source ID: Drain Current RDS(ON): Drain-Source On-State Resistance VGS(TH): Gate-Source Threshold Voltage CISS: Drain-Source Input Capacitance SOT-23 Name VDS ID RDS(ON) VGS(TH) CISS Order Number IRLML5103 30V 760mA 600 mOhm -- 75pF @ 25V Digikey: IRLML5103PBFCT-ND IRLML6401 12V 4.3A 50 mOhm 950mV @ 250µA 830pF @ 10V Digikey: IRLML6401PBFTR-ND NTR0202PL 20V 400mA 800 mOhm 2.3V @ 250uA 70pF @ 5V Digikey: NTR0202PLT1GOSTR-ND NTR4101PT1G 20V 1.8A 85 mOhm 1.2V @ 250uA 675pF @ 10V Digikey: NTR4101PT1GOSCT-ND DMP2004K 20V 600mA 900 mOhm 1V @ 250uA 175pF @ 16V Digikey: DMP2004KDICT-ND PMV65XP 20V 3.9A 76 mOhm 950mV @ 1mA 725pF @ 20V Digikey: 568-2358-2-ND TO-252 Name VDS ID RDS(ON) VGS(TH) CISS Order Number AOD417 30V 25A 34 mOhm 3V @ 250µA 920pF @ 15V Digikey: 785-1106-2-ND
R0 R1-R17 R19 R21-R47 R53-R63 R65-R82 R86-R95 R100 R101 R113-R117 = standardparts:RESISTOR
RP2040 = RpiPico:RP2040-QFN56
SAW = AFS14A04-1575.42-T3:AFS14A04-1575.42-T3; MANUFACTURER: Abracon; MAXIMUM_PACKAGE_HEIGHT: 0.7mm; PARTREV: 04.16.13; SNAPEDA_PN: AFS14A04-1575.42-T3; STANDARD: Manufacturer Recommendations
U1 = BNO055:BNO055: BNO055 9-axis Absolute Orientation Sensor ( SiP ) w/Sensors and Sensor Fusion Check availability <https://pricing.snapeda.com/parts/BNO055/Bosch/view-part?ref=eda>; AVAILABILITY: In Stock; CHECK_PRICES: https://www.snapeda.com/parts/BNO055/Bosch+Sensortec/view-part/?ref=eda; DESCRIPTION: BNO055 series Accelerometer, Gyroscope, Magnetometer, 3 Axis Sensor Evaluation Board; MF: Bosch; MP: BNO055; PACKAGE: LGA-28 Bosch; PRICE: None; PURCHASE-URL: https://www.snapeda.com/api/url_track_click_mouser/?unipart_id=51961&manufacturer=Bosch&part_name=BNO055&search_term=None; SNAPEDA_LINK: https://www.snapeda.com/parts/BNO055/Bosch+Sensortec/view-part/?ref=snap
U2 U3 U5 U7 U10 = BS170F:BS170F: DMOS FET Check availability <https://pricing.snapeda.com/parts/BS170F/Diodes%20Inc./view-part?ref=eda>; AVAILABILITY: In Stock; CHECK_PRICES: https://www.snapeda.com/parts/BS170F/Diodes+Inc./view-part/?ref=eda; DESCRIPTION: N-Channel 60 V 150µA (Ta) 330mW (Ta) Surface Mount SOT-23-3; MF: Diodes Inc.; MP: BS170F; PACKAGE: SOT-23 Multicomp; PRICE: None; SNAPEDA_LINK: https://www.snapeda.com/parts/BS170F/Diodes+Inc./view-part/?ref=snap
U4 = LM1117-3.3:LM1117-3.3: IC REG LDO 800MA 3.3V Check availability <https://pricing.snapeda.com/parts/LM1117-3.3/Texas%20Instruments/view-part?ref=eda>; AVAILABILITY: In Stock; CHECK_PRICES: https://www.snapeda.com/parts/LM1117-3.3/Texas+Instruments/view-part/?ref=eda; DESCRIPTION: Linear Voltage Regulator IC Positive Fixed 1 Output 800mA DDPAK/TO-263-3; MF: Texas Instruments; MP: LM1117-3.3; PACKAGE: None; PRICE: None; SNAPEDA_LINK: https://www.snapeda.com/parts/LM1117-3.3/Texas+Instruments/view-part/?ref=snap
U6 U9 U15 U16 = ADS1115IDGSR:ADS1115IDGSR: Check availability <https://pricing.snapeda.com/parts/ADS1115IDGSR/Texas%20Instruments/view-part?ref=eda>; AVAILABILITY: In Stock; CHECK_PRICES: https://www.snapeda.com/parts/ADS1115IDGSR/Texas+Instruments/view-part/?ref=eda; DESCRIPTION: 16-bit, 860-SPS, 4-channel, delta-sigma ADC with PGA, oscillator, VREF, comparator and I2C; MF: Texas Instruments; MP: ADS1115IDGSR; PACKAGE: VSSOP-10 Texas Instruments; PRICE: None; PURCHASE-URL: https://www.snapeda.com/api/url_track_click_mouser/?unipart_id=45903&manufacturer=Texas Instruments&part_name=ADS1115IDGSR&search_term=ads1115; SNAPEDA_LINK: https://www.snapeda.com/parts/ADS1115IDGSR/Texas+Instruments/view-part/?ref=snap
U8 U11 U13 U14 U17 = MIC29302WU:MIC29302WU-TR; COPYRIGHT: Copyright (C) 2024 Ultra Librarian. All rights reserved.; MANUFACTURER_PART_NUMBER: MIC29302WU-TR; MFR_NAME: Microchip
U12 = CP2102:CP2102: USB to UART Bridge Check availability <https://pricing.snapeda.com/parts/CP2102/Silicon%20Labs/view-part?ref=eda>; AVAILABILITY: In Stock; CHECK_PRICES: https://www.snapeda.com/parts/CP2102/Silicon+Labs/view-part/?ref=eda; DESCRIPTION: CP2102N USB 2.0 to UART (RS232) Bridge Interface Evaluation Board; MF: Silicon Labs; MP: CP2102; PACKAGE: QFN-28 Silicon Labs; PRICE: None; PURCHASE-URL: https://www.snapeda.com/api/url_track_click_mouser/?unipart_id=228557&manufacturer=Silicon Labs&part_name=CP2102&search_term=None; SNAPEDA_LINK: https://www.snapeda.com/parts/CP2102/Silicon+Labs/view-part/?ref=snap
U19 U22 = MT3608:MT3608: High Efficiency 1.2MHz 2A Step Up Converter Check availability <https://pricing.snapeda.com/parts/MT3608/Aerosemi%20Technology%20Co.%2C%20Ltd/view-part?ref=eda>; AVAILABILITY: Not in stock; CHECK_PRICES: https://www.snapeda.com/parts/MT3608/Aerosemi+Technology+Co.%252C+Ltd/view-part/?ref=eda; DESCRIPTION: High Efficiency 1.2MHz 2A Step Up Converter; MF: Aerosemi Technology Co., Ltd; MP: MT3608; PACKAGE: Package; PRICE: None; SNAPEDA_LINK: https://www.snapeda.com/parts/MT3608/Aerosemi+Technology+Co.%252C+Ltd/view-part/?ref=snap
U20 = AP2210K-3.3TRG1:AP2210K-3.3TRG1: https://www.mouser.co.cr/ProductDetail/Diodes-Incorporated/AP2210K-33TRG1?qs=%2Fha2pyFadujtZ3DhVlxUwc1Ul06BXujwB7t%252B8jLX%2FdxIEGMLBWODYg%3D%3D Check availability <https://pricing.snapeda.com/parts/AP2210K-3.3TRG1/Diodes%20Inc./view-part?ref=eda>; AVAILABILITY: In Stock; CHECK_PRICES: https://www.snapeda.com/parts/AP2210K-3.3TRG1/Diodes+Inc./view-part/?ref=eda; DESCRIPTION: Voltage Regulators, LDO, 300mA CMOS LDO 3.3V 250mV | Diodes Inc AP2210K-3.3TRG1; MF: Diodes Inc.; MP: AP2210K-3.3TRG1; PACKAGE: SOT-23-5 Diodes Inc.; PRICE: None; SNAPEDA_LINK: https://www.snapeda.com/parts/AP2210K-3.3TRG1/Diodes+Inc./view-part/?ref=snap
U$3 = SN74LVC1G04DBVR:SN74LVC1G04DBVR: Check availability <https://pricing.snapeda.com/parts/SN74LVC1G04DBVR/UMW/view-part?ref=eda>; AVAILABILITY: In Stock; CHECK_PRICES: https://www.snapeda.com/parts/SN74LVC1G04DBVR/Umwelt+Sensor+Teknik/view-part/?ref=eda; DESCRIPTION: Inverter IC 1 Channel SOT-23-5; MF: UMW; MP: SN74LVC1G04DBVR; PACKAGE: None; PRICE: None; SNAPEDA_LINK: https://www.snapeda.com/parts/SN74LVC1G04DBVR/Umwelt+Sensor+Teknik/view-part/?ref=snap
X1 = con-molex:22-23-2121: .100" (2.54mm) Center Header - 12 Pin; MF: MOLEX; MPN: 22-23-2121; OC_FARNELL: 1462935; OC_NEWARK: 56H0456
X6 = microbuilder:USB_C: USB Type-C USB 2.0 Connector
XBEE = XBP9B-XCST-021:XBP9B-XCST-021: XBee-PRO 900HP DigiMesh 900 MHz 200 Kbps RF Module with U.FL Connector Check availability <https://pricing.snapeda.com/parts/XBP9B-XCST-021/Digi%20International/view-part?ref=eda>; AVAILABILITY: In Stock; CHECK_PRICES: https://www.snapeda.com/parts/XBP9B-XCST-021/Digi+International/view-part/?ref=eda; DESCRIPTION: General ISM < 1GHz - Transceiver Module 920MHz Antenna Not Included, RP-SMA Through Hole; MF: Digi International; MP: XBP9B-XCST-021; PACKAGE: Module Digi International; PRICE: None; PURCHASE-URL: https://www.snapeda.com/api/url_track_click_mouser/?unipart_id=521579&manufacturer=Digi International&part_name=XBP9B-XCST-021&search_term=None; SNAPEDA_LINK: https://www.snapeda.com/parts/XBP9B-XCST-021/Digi+International/view-part/?ref=snap
XTAL = crystal:ASE: 3.3Vdc CMOS SMD CRYSTAL CLOCK OSCILLATOR SOurce: www.abracon.com; OC_FARNELL: unknown; OC_NEWARK: unknown
Y1 = FC-135_32.7680KA-A0:FC-135_32.7680KA-A0: None Check availability <https://pricing.snapeda.com/parts/FC-135%2032.7680KA-A0/EPSON/view-part?ref=eda>; AVAILABILITY: In Stock; CHECK_PRICES: https://www.snapeda.com/parts/FC-135%2032.7680KA-A0/EPSON/view-part/?ref=eda; DESCRIPTION: 32.768 kHz ±20ppm Crystal 12.5pF 70 kOhms 2-SMD, No Lead; MF: EPSON; MP: FC-135 32.7680KA-A0; PACKAGE: SMD-2 Epson; PRICE: None; SNAPEDA_LINK: https://www.snapeda.com/parts/FC-135%2032.7680KA-A0/EPSON/view-part/?ref=snap